# Altium project NB3000XN.PRJPCB (part 1 of 3)
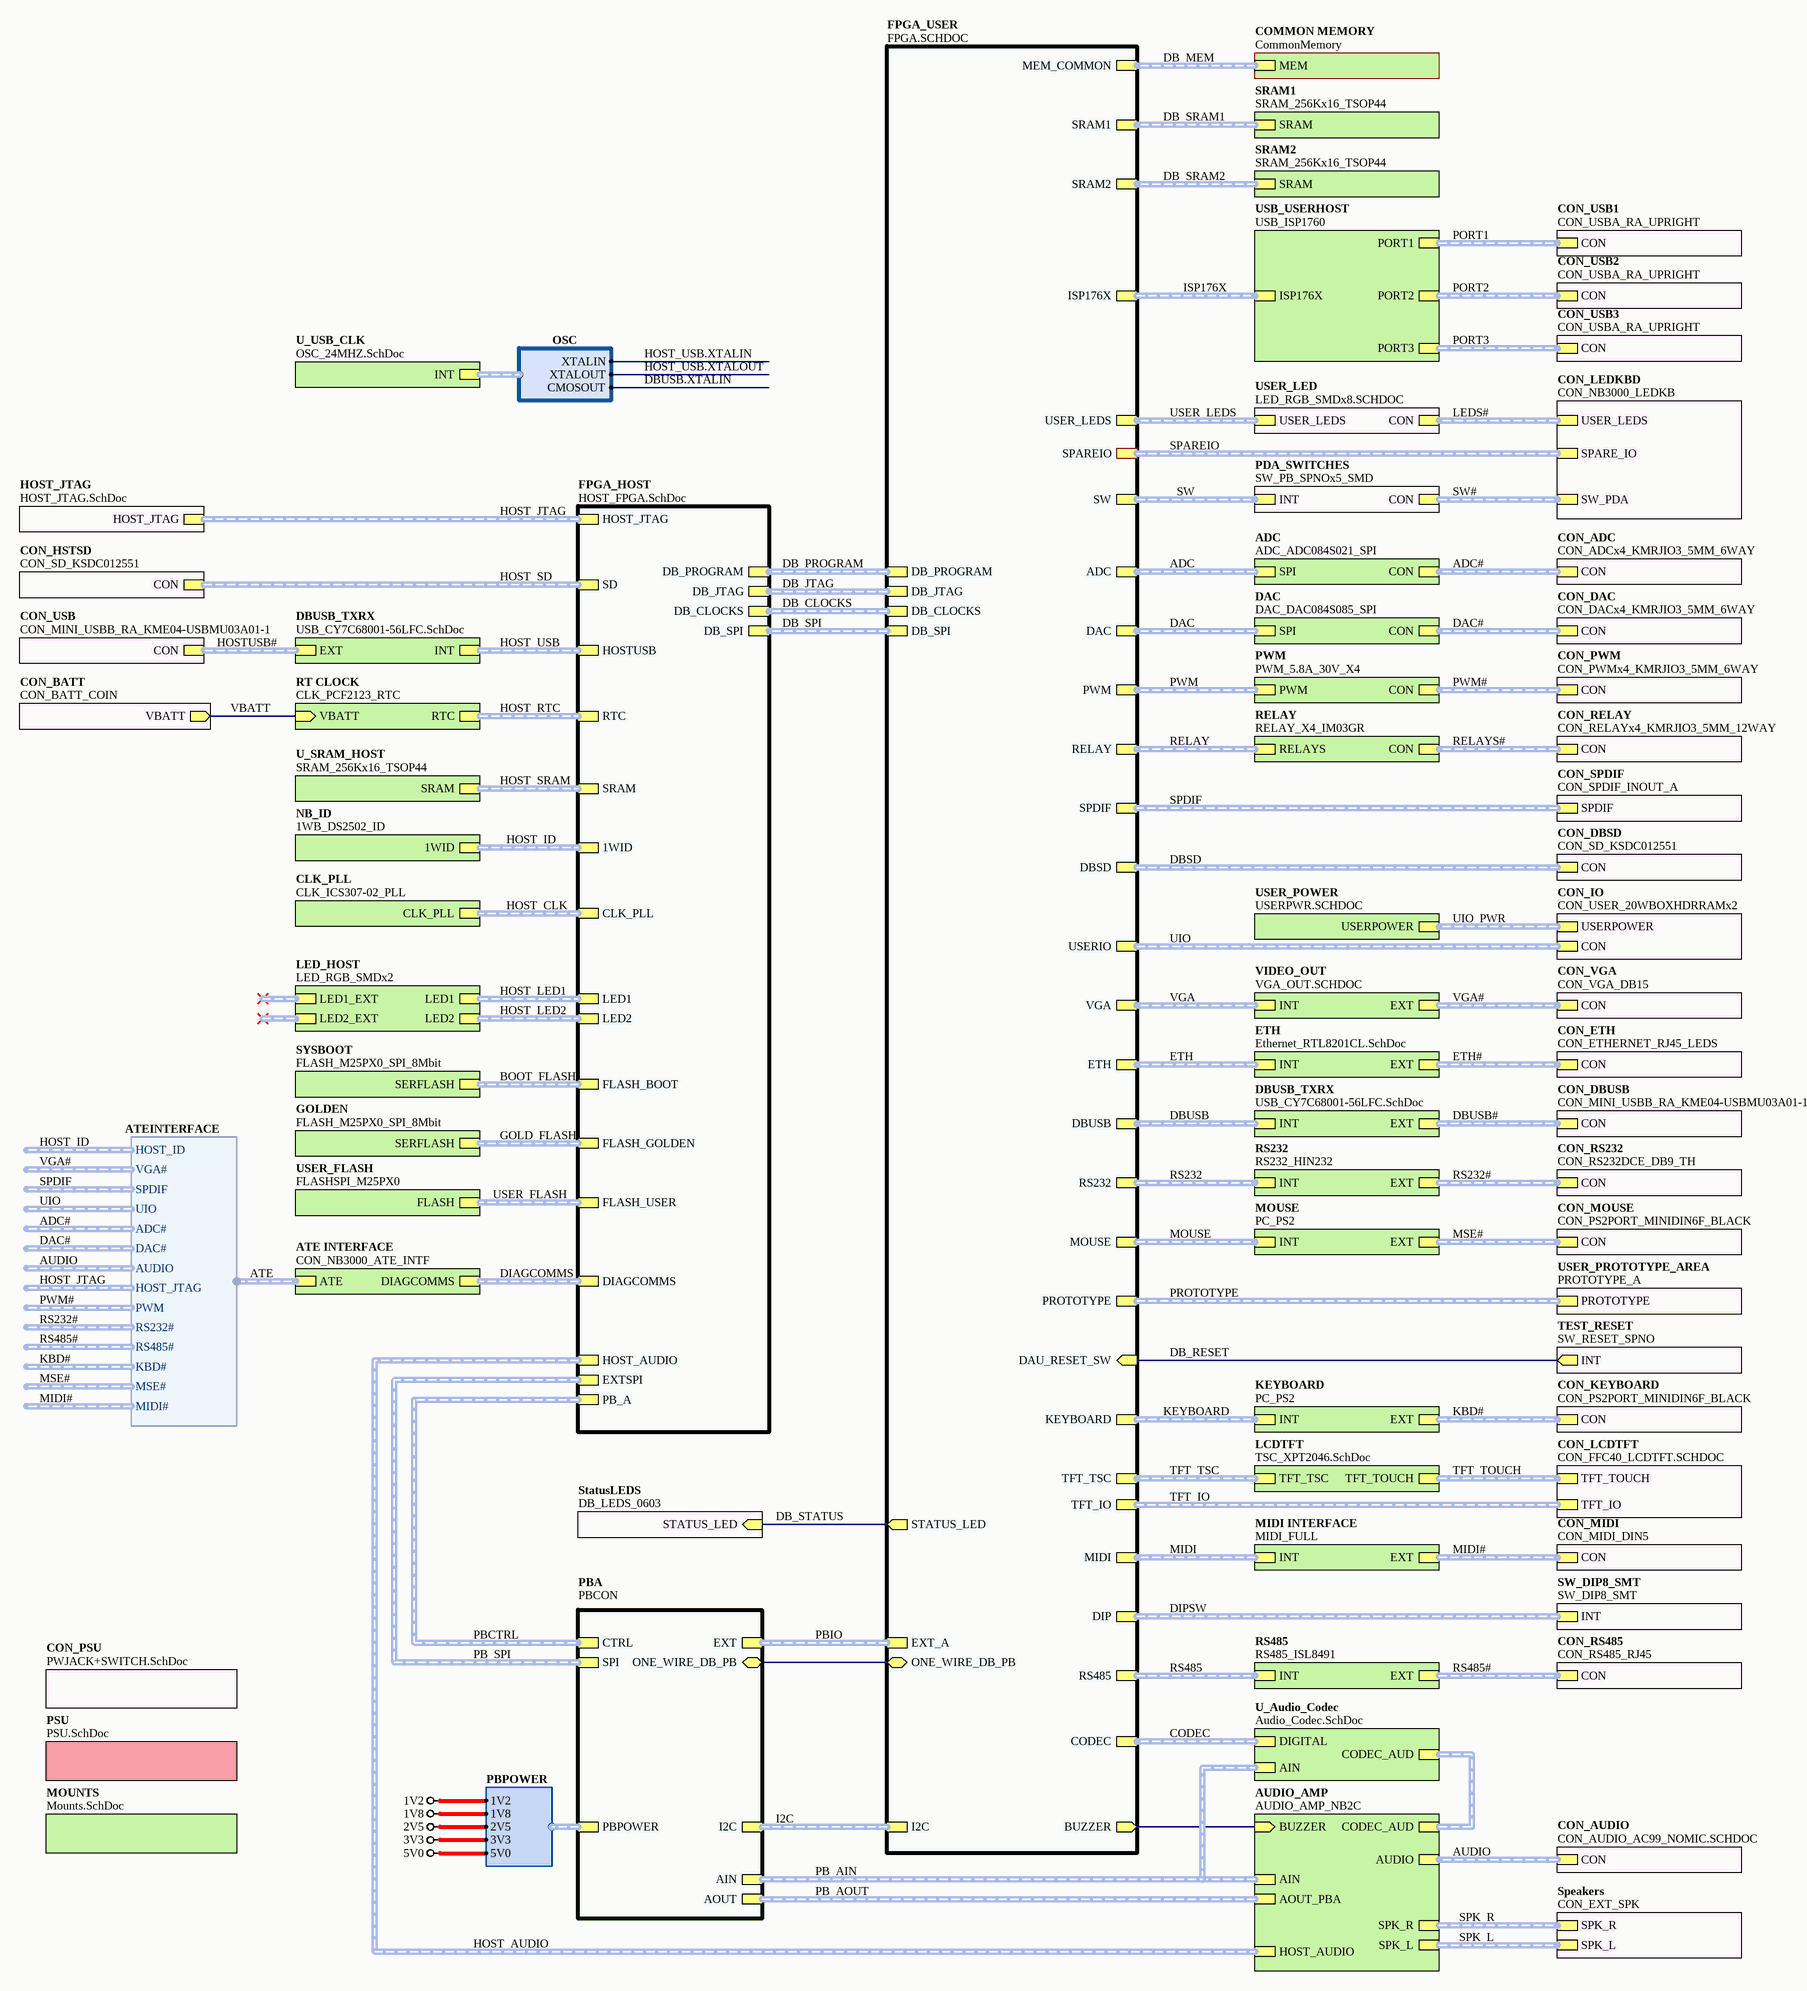
[diagram p0: NB3000XN_Top.SchDoc]
ProjectAddress1: 3 Minna Close; ProjectAddress2: Belrose; ProjectAddress3: NSW 2085; ProjectAddress4: Australia; ProjectAssyNum: TBA; ProjectOrganization: Altium Limited; ProjectRevision: 04; ProjectTitle: NB3000XN - Xilinx; ProjectTotalSheets: 106
22 sheets, 343 parts. Net scope: hierarchical (ports join the sheet entries above them; power ports are global).
Board files: NB3000XN.PcbDoc, NB3000XN_Panel.PcbDoc
Sheets:
  NB3000XN_Top.SchDoc
    PSU = PSU.SchDoc
    FPGA_USER = FPGA.SCHDOC
      U_FPGA_Power = FPGA_NonIO.SchDoc
      USER_DECOUPLING_CAPS_1V2 = FPGA_Bypass_1V2.SCHDOC
      USER_DECOUPLING_CAPS_3V3 = FPGA_Bypass_3V3.SCHDOC
    VIDEO_OUT = VGA_OUT.SCHDOC
      U_VIDEO_DAC = VIDEO_DAC_THS8134B.SchDoc
    FPGA_HOST = Host_FPGA.SchDoc
      HOST_NonIO = HOST_FPGA_NonIO.SchDoc
      HOST_DECOUPLING_CAPS_1V2 = FPGA_Bypass_1V2.SCHDOC
      HOST_DECOUPLING_CAPS_3V3 = FPGA_Bypass_3V3.SCHDOC
    HOST_JTAG = HOST_JTAG.SchDoc
    DBUSB_TXRX = USB_CY7C68001-56LFC.SchDoc
    ETH = Ethernet_RTL8201CL.SchDoc
    LCDTFT = TSC_XPT2046.SchDoc
    USER_LED = LED_RGB_SMDx8.SCHDOC
    U_Audio_Codec = Audio_Codec.SchDoc
    CON_LCDTFT = CON_FFC40_LCDTFT.SCHDOC
    MOUNTS = Mounts.SchDoc
    CON_PSU = PWJACK+SWITCH.SchDoc
    DBUSB_TXRX = USB_CY7C68001-56LFC.SchDoc
    USER_POWER = USERPWR.SchDoc
    CON_AUDIO = CON_AUDIO_AC99_NOMIC.SchDoc
    U_USB_CLK = OSC_24MHZ.SchDoc

## Sheet NB3000XN_Top.SchDoc: NB3000XN Top Level
size A2; Revision: 5; SheetNumber: 1; SheetTotal: 106; Organization: Altium Limited.; Address1: Level 3, 12a Rodborough Rd; Address2: Frenchs Forest 2086; Address3: NSW; Address4: AUSTRALIA

### Sub-sheets
ADC = ADC_ADC084S021_SPI (file not in this document): SPI (harness ADC_SPI), CON (harness ADC_CON)
ATE INTERFACE = CON_NB3000_ATE_INTF (file not in this document): ATE (harness ATEINTERFACE), DIAGCOMMS (harness DIAGCOMMS)
AUDIO_AMP = AUDIO_AMP_NB2C (file not in this document): BUZZER (in), CODEC_AUD (harness STEREO), AUDIO (harness AUDIO_EXT), SPK_L (harness SPEAKER), SPK_R (harness SPEAKER), HOST_AUDIO (harness STEREO), AIN (harness AUDIO_IN), AOUT_PBA (harness AUDIO_OUT)
CLK_PLL = CLK_ICS307-02_PLL (file not in this document): CLK_PLL (harness CLK_PLL)
COMMON MEMORY = CommonMemory (file not in this document): MEM (harness HOSTMEMORY)
CON_ADC = CON_ADCx4_KMRJIO3_5MM_6WAY (file not in this document): CON (harness ADC_CON)
CON_AUDIO = CON_AUDIO_AC99_NOMIC.SCHDOC: CON (harness AUDIO_EXT)
CON_BATT = CON_BATT_COIN (file not in this document): VBATT (out)
CON_DAC = CON_DACx4_KMRJIO3_5MM_6WAY (file not in this document): CON (harness DAC_CON)
CON_DBSD = CON_SD_KSDC012551 (file not in this document): CON (harness SD)
CON_DBUSB = CON_MINI_USBB_RA_KME04-USBMU03A01-1 (file not in this document): CON (harness USB_CON)
CON_ETH = CON_ETHERNET_RJ45_LEDS (file not in this document): CON (harness ETHERNET_CON)
CON_HSTSD = CON_SD_KSDC012551 (file not in this document): CON (harness SD)
CON_IO = CON_USER_20WBOXHDRRAMx2 (file not in this document): CON (harness IO36), USERPOWER (harness USERPOWER)
CON_KEYBOARD = CON_PS2PORT_MINIDIN6F_BLACK (file not in this document): CON (harness PS2)
CON_LCDTFT = CON_FFC40_LCDTFT.SCHDOC: TFT_IO (harness TFT_IO), TFT_TOUCH (harness TFT_TOUCH)
CON_LEDKBD = CON_NB3000_LEDKB (file not in this document): USER_LEDS (harness User_LEDS), SW_PDA (harness SW5), SPARE_IO (harness SPAREIO)
CON_MIDI = CON_MIDI_DIN5 (file not in this document): CON (harness MIDI_IO)
CON_MOUSE = CON_PS2PORT_MINIDIN6F_BLACK (file not in this document): CON (harness PS2)
CON_PSU = PWJACK+SWITCH.SchDoc: no entries
CON_PWM = CON_PWMx4_KMRJIO3_5MM_6WAY (file not in this document): CON (harness PWM_CON)
CON_RELAY = CON_RELAYx4_KMRJIO3_5MM_12WAY (file not in this document): CON (harness RELAY_CON4)
CON_RS232 = CON_RS232DCE_DB9_TH (file not in this document): CON (harness RS232_EXT)
CON_RS485 = CON_RS485_RJ45 (file not in this document): CON (harness RS485_EXT)
CON_SPDIF = CON_SPDIF_INOUT_A (file not in this document): SPDIF (harness SPDIF)
CON_USB = CON_MINI_USBB_RA_KME04-USBMU03A01-1 (file not in this document): CON (harness USB_CON)
CON_USB1 = CON_USBA_RA_UPRIGHT (file not in this document): CON (harness USB_CON)
CON_USB2 = CON_USBA_RA_UPRIGHT (file not in this document): CON (harness USB_CON)
CON_USB3 = CON_USBA_RA_UPRIGHT (file not in this document): CON (harness USB_CON)
CON_VGA = CON_VGA_DB15 (file not in this document): CON (harness VGA_CON)
DAC = DAC_DAC084S085_SPI (file not in this document): SPI (harness DAC_SPI), CON (harness DAC_CON)
DBUSB_TXRX = USB_CY7C68001-56LFC.SchDoc: EXT (harness USB_CON), INT (harness USB_INTF)
DBUSB_TXRX = USB_CY7C68001-56LFC.SchDoc: EXT (harness USB_CON), INT (harness USB_INTF)
ETH = Ethernet_RTL8201CL.SchDoc: INT (harness Ethernet), EXT (harness ETHERNET_CON)
FPGA_HOST = HOST_FPGA.SchDoc: HOST_JTAG (harness HARDSOFT_JTAG), LED1 (harness RGB_LED), LED2 (harness RGB_LED), 1WID (harness 1W), DB_PROGRAM (harness DAU_CTRL), CLK_PLL (harness CLK_PLL), FLASH_BOOT (harness SERFLASH), HOSTUSB (harness USB_INTF), SRAM (harness SRAM-256Kx16), RTC (harness RTC), SD (harness SD), HOST_AUDIO (harness STEREO), DB_JTAG (harness HARDSOFT_JTAG), DB_CLOCKS (harness DB_CLOCKS), FLASH_USER (harness SERIALFLASH), DB_SPI (harness DB_SPI), PB_A (harness PBCTRL), EXTSPI (harness EXTSPI), FLASH_GOLDEN (harness SERFLASH), DIAGCOMMS (harness DIAGCOMMS)
FPGA_USER = FPGA.SCHDOC: SRAM1 (harness SRAM-256Kx16), SRAM2 (harness SRAM-256Kx16), MEM_COMMON (harness HOSTMEMORY), DAU_RESET_SW (in), BUZZER (out), ONE_WIRE_DB_PB (bidir), SW (harness SW5), DIP (harness SW8), USERIO (harness IO36), EXT_A (harness PBIO), RS232 (harness RS232_INT), KEYBOARD (harness PS2), MOUSE (harness PS2), TFT_IO (harness TFT_IO), DB_PROGRAM (harness DAU_CTRL), STATUS_LED (out), USER_LEDS (harness USER_LEDS), RELAY (harness RELAY4), I2C (harness I2C), CODEC (harness AUDIO_DIGITAL), VGA (harness VGA), ETH (harness Ethernet), DBSD (harness SD), DBUSB (harness USB_INTF), PWM (harness PWM4), SPDIF (harness SPDIF), DAC (harness DAC_SPI), ADC (harness ADC_SPI), RS485 (harness RS485_INT), MIDI (harness MIDI_INT), DB_JTAG (harness HARDSOFT_JTAG), DB_CLOCKS (harness DB_CLOCKS), DB_SPI (harness DB_SPI), ISP176X (harness ISP176X), PROTOTYPE (harness IO36), SPAREIO (harness SPAREIO), TFT_TSC (harness TFT_TSC)
GOLDEN = FLASH_M25PX0_SPI_8Mbit (file not in this document): SERFLASH (harness SERFLASH)
HOST_JTAG = HOST_JTAG.SchDoc: HOST_JTAG (harness HARDSOFT_JTAG)
KEYBOARD = PC_PS2 (file not in this document): EXT (harness PS2), INT (harness PS2)
LCDTFT = TSC_XPT2046.SchDoc: TFT_TSC (harness TFT_TSC), TFT_TOUCH (harness TFT_TOUCH)
LED_HOST = LED_RGB_SMDx2 (file not in this document): LED1 (harness RGB_LED), LED2 (harness RGB_LED), LED1_EXT (harness RGB_LED), LED2_EXT (harness RGB_LED)
MIDI INTERFACE = MIDI_FULL (file not in this document): INT (harness MIDI_INT), EXT (harness MIDI_IO)
MOUNTS = Mounts.SchDoc: no entries
MOUSE = PC_PS2 (file not in this document): EXT (harness PS2), INT (harness PS2)
NB_ID = 1WB_DS2502_ID (file not in this document): 1WID (harness 1W)
PBA = PBCON (file not in this document): EXT (harness PBIO), ONE_WIRE_DB_PB (bidir), AIN (harness AUDIO_IN), I2C (harness I2C), SPI (harness EXTSPI), AOUT (harness AUDIO_OUT), CTRL (harness PBCTRL), PBPOWER (harness PBPOWER)
PDA_SWITCHES = SW_PB_SPNOx5_SMD (file not in this document): INT (harness SW5), CON (harness SW5)
PSU = PSU.SchDoc: no entries
PWM = PWM_5.8A_30V_X4 (file not in this document): PWM (harness PWM4), CON (harness PWM_CON)
RELAY = RELAY_X4_IM03GR (file not in this document): RELAYS (harness RELAY4), CON (harness RELAY_CON4)
RS232 = RS232_HIN232 (file not in this document): INT (harness RS232_INT), EXT (harness RS232_EXT)
RS485 = RS485_ISL8491 (file not in this document): INT (harness RS485_INT), EXT (harness RS485_EXT)
RT CLOCK = CLK_PCF2123_RTC (file not in this document): VBATT (in), RTC (harness RTC)
Speakers = CON_EXT_SPK (file not in this document): SPK_L (harness SPEAKER), SPK_R (harness SPEAKER)
SRAM1 = SRAM_256Kx16_TSOP44 (file not in this document): SRAM (harness SRAM-256Kx16)
SRAM2 = SRAM_256Kx16_TSOP44 (file not in this document): SRAM (harness SRAM-256Kx16)
StatusLEDS = DB_LEDS_0603 (file not in this document): STATUS_LED (in)
SW_DIP8_SMT = SW_DIP8_SMT (file not in this document): INT (harness SW8)
SYSBOOT = FLASH_M25PX0_SPI_8Mbit (file not in this document): SERFLASH (harness SERFLASH)
TEST_RESET = SW_RESET_SPNO (file not in this document): INT (out)
U_Audio_Codec = Audio_Codec.SchDoc: DIGITAL (harness AUDIO_DIGITAL), CODEC_AUD (harness STEREO), AIN (harness AUDIO_IN)
U_SRAM_HOST = SRAM_256Kx16_TSOP44 (file not in this document): SRAM (harness SRAM-256Kx16)
U_USB_CLK = OSC_24MHZ.SchDoc: INT (harness OSC)
USB_USERHOST = USB_ISP1760 (file not in this document): ISP176X (harness ISP176X), PORT1 (harness USB_CON), PORT2 (harness USB_CON), PORT3 (harness USB_CON)
USER_FLASH = FLASHSPI_M25PX0 (file not in this document): FLASH (harness SERIALFLASH)
USER_LED = LED_RGB_SMDx8.SCHDOC: USER_LEDS (harness USER_LEDS), CON (harness UseR_LEDS)
USER_POWER = USERPWR.SCHDOC: USERPOWER (harness USERPOWER)
USER_PROTOTYPE_AREA = PROTOTYPE_A (file not in this document): PROTOTYPE (harness IO36)
VIDEO_OUT = VGA_OUT.SCHDOC: INT (harness VGA), EXT (harness VGA_CON)

### Harnesses
PBPOWER: 1V2, 1V8, 2V5, 3V3, 5V0
ATEINTERFACE: VGA#, SPDIF, UIO, ADC#, DAC#, AUDIO, HOST_JTAG, PWM, RS232#, RS485#, KBD#, MSE#, MIDI#, HOST_ID
OSC: CMOSOUT, XTALIN, XTALOUT

### Nets
BUZZER: sheet FPGA_USER/BUZZER, sheet AUDIO_AMP/BUZZER
DB_RESET: sheet FPGA_USER/DAU_RESET_SW, sheet TEST_RESET/INT
DB_STATUS: sheet StatusLEDS/STATUS_LED, sheet FPGA_USER/STATUS_LED  [project net DB_PROGRAM.DONE]
ONE_WIRE_DB_PB: sheet FPGA_USER/ONE_WIRE_DB_PB, sheet PBA/ONE_WIRE_DB_PB
VBATT: sheet CON_BATT/VBATT, sheet RT CLOCK/VBATT

### Buses and harness runs
harness ADC = sheet ADC/SPI = sheet FPGA_USER/ADC
harness ADC# = sheet ADC/CON = sheet CON_ADC/CON
harness ATE = sheet ATE INTERFACE/ATE
harness AUDIO = sheet AUDIO_AMP/AUDIO = sheet CON_AUDIO/CON
harness BOOT_FLASH = sheet FPGA_HOST/FLASH_BOOT = sheet SYSBOOT/SERFLASH
harness CODEC = sheet FPGA_USER/CODEC = sheet U_Audio_Codec/DIGITAL
harness DAC = sheet DAC/SPI = sheet FPGA_USER/DAC
harness DAC# = sheet CON_DAC/CON = sheet DAC/CON
harness DB_CLOCKS = sheet FPGA_HOST/DB_CLOCKS = sheet FPGA_USER/DB_CLOCKS
harness DB_JTAG = sheet FPGA_HOST/DB_JTAG = sheet FPGA_USER/DB_JTAG
harness DB_MEM = sheet COMMON MEMORY/MEM = sheet FPGA_USER/MEM_COMMON
harness DB_PROGRAM = sheet FPGA_HOST/DB_PROGRAM = sheet FPGA_USER/DB_PROGRAM
harness DB_SPI = sheet FPGA_HOST/DB_SPI = sheet FPGA_USER/DB_SPI
harness DB_SRAM1 = sheet FPGA_USER/SRAM1 = sheet SRAM1/SRAM
harness DB_SRAM2 = sheet FPGA_USER/SRAM2 = sheet SRAM2/SRAM
harness DBSD = sheet CON_DBSD/CON = sheet FPGA_USER/DBSD
harness DBUSB = sheet DBUSB_TXRX/INT = sheet FPGA_USER/DBUSB
harness DBUSB# = sheet CON_DBUSB/CON = sheet DBUSB_TXRX/EXT
harness DIAGCOMMS = sheet ATE INTERFACE/DIAGCOMMS = sheet FPGA_HOST/DIAGCOMMS
harness DIPSW = sheet FPGA_USER/DIP = sheet SW_DIP8_SMT/INT
harness ETH = sheet ETH/INT = sheet FPGA_USER/ETH
harness ETH# = sheet CON_ETH/CON = sheet ETH/EXT
harness GOLD_FLASH = sheet FPGA_HOST/FLASH_GOLDEN = sheet GOLDEN/SERFLASH
harness HOST_AUDIO = sheet AUDIO_AMP/HOST_AUDIO = sheet FPGA_HOST/HOST_AUDIO
harness HOST_CLK = sheet CLK_PLL/CLK_PLL = sheet FPGA_HOST/CLK_PLL
harness HOST_ID = sheet FPGA_HOST/1WID = sheet NB_ID/1WID
harness HOST_JTAG = sheet FPGA_HOST/HOST_JTAG = sheet HOST_JTAG/HOST_JTAG
harness HOST_LED1 = sheet FPGA_HOST/LED1 = sheet LED_HOST/LED1
harness HOST_LED2 = sheet FPGA_HOST/LED2 = sheet LED_HOST/LED2
harness HOST_RTC = sheet FPGA_HOST/RTC = sheet RT CLOCK/RTC
harness HOST_SD = sheet CON_HSTSD/CON = sheet FPGA_HOST/SD
harness HOST_SRAM = sheet FPGA_HOST/SRAM = sheet U_SRAM_HOST/SRAM
harness HOST_USB = sheet DBUSB_TXRX/INT = sheet FPGA_HOST/HOSTUSB
harness HOSTUSB# = sheet CON_USB/CON = sheet DBUSB_TXRX/EXT
harness I2C = sheet FPGA_USER/I2C = sheet PBA/I2C
harness ISP176X = sheet FPGA_USER/ISP176X = sheet USB_USERHOST/ISP176X
harness KBD# = sheet CON_KEYBOARD/CON = sheet KEYBOARD/EXT
harness KEYBOARD = sheet FPGA_USER/KEYBOARD = sheet KEYBOARD/INT
harness LEDS# = sheet CON_LEDKBD/USER_LEDS = sheet USER_LED/CON
harness MIDI = sheet FPGA_USER/MIDI = sheet MIDI INTERFACE/INT
harness MIDI# = sheet CON_MIDI/CON = sheet MIDI INTERFACE/EXT
harness MOUSE = sheet FPGA_USER/MOUSE = sheet MOUSE/INT
harness MSE# = sheet CON_MOUSE/CON = sheet MOUSE/EXT
harness PB_AIN = sheet AUDIO_AMP/AIN = sheet PBA/AIN = sheet U_Audio_Codec/AIN
harness PB_AOUT = sheet AUDIO_AMP/AOUT_PBA = sheet PBA/AOUT
harness PB_SPI = sheet FPGA_HOST/EXTSPI = sheet PBA/SPI
harness PBCTRL = sheet FPGA_HOST/PB_A = sheet PBA/CTRL
harness PBIO = sheet FPGA_USER/EXT_A = sheet PBA/EXT
harness PORT1 = sheet CON_USB1/CON = sheet USB_USERHOST/PORT1
harness PORT2 = sheet CON_USB2/CON = sheet USB_USERHOST/PORT2
harness PORT3 = sheet CON_USB3/CON = sheet USB_USERHOST/PORT3
harness PROTOTYPE = sheet FPGA_USER/PROTOTYPE = sheet USER_PROTOTYPE_AREA/PROTOTYPE
harness PWM = sheet FPGA_USER/PWM = sheet PWM/PWM
harness PWM# = sheet CON_PWM/CON = sheet PWM/CON
harness RELAY = sheet FPGA_USER/RELAY = sheet RELAY/RELAYS
harness RELAYS# = sheet CON_RELAY/CON = sheet RELAY/CON
harness RS232 = sheet FPGA_USER/RS232 = sheet RS232/INT
harness RS232# = sheet CON_RS232/CON = sheet RS232/EXT
harness RS485 = sheet FPGA_USER/RS485 = sheet RS485/INT
harness RS485# = sheet CON_RS485/CON = sheet RS485/EXT
harness sheet AUDIO_AMP/CODEC_AUD = sheet U_Audio_Codec/CODEC_AUD
harness SPAREIO = sheet CON_LEDKBD/SPARE_IO = sheet FPGA_USER/SPAREIO
harness SPDIF = sheet CON_SPDIF/SPDIF = sheet FPGA_USER/SPDIF
harness SPK_L = sheet AUDIO_AMP/SPK_L = sheet Speakers/SPK_L
harness SPK_R = sheet AUDIO_AMP/SPK_R = sheet Speakers/SPK_R
harness SW = sheet FPGA_USER/SW = sheet PDA_SWITCHES/INT
harness SW# = sheet CON_LEDKBD/SW_PDA = sheet PDA_SWITCHES/CON
harness TFT_IO = sheet CON_LCDTFT/TFT_IO = sheet FPGA_USER/TFT_IO
harness TFT_TOUCH = sheet CON_LCDTFT/TFT_TOUCH = sheet LCDTFT/TFT_TOUCH
harness TFT_TSC = sheet FPGA_USER/TFT_TSC = sheet LCDTFT/TFT_TSC
harness UIO = sheet CON_IO/CON = sheet FPGA_USER/USERIO
harness UIO_PWR = sheet CON_IO/USERPOWER = sheet USER_POWER/USERPOWER
harness USER_FLASH = sheet FPGA_HOST/FLASH_USER = sheet USER_FLASH/FLASH
harness USER_LEDS = sheet FPGA_USER/USER_LEDS = sheet USER_LED/USER_LEDS
harness VGA = sheet FPGA_USER/VGA = sheet VIDEO_OUT/INT
harness VGA# = sheet CON_VGA/CON = sheet VIDEO_OUT/EXT

### Notes on the sheet
- Project Title
- Sheet Title
- Size:
- Date:
- File:
- A2
- Assy:
- Time:
- Revision:
- Sheet
- of

## Sheet PSU.SchDoc: NB3000 POWER SUPPLIES
size A4; Organization: Altium Limited.; Address1: 3 Minna Close; Address2: Belrose; Address3: NSW 2085; Address4: AUSTRALIA; DocumentNumber: 7; Revision: 6; SheetNumber: 8; SheetTotal: 78
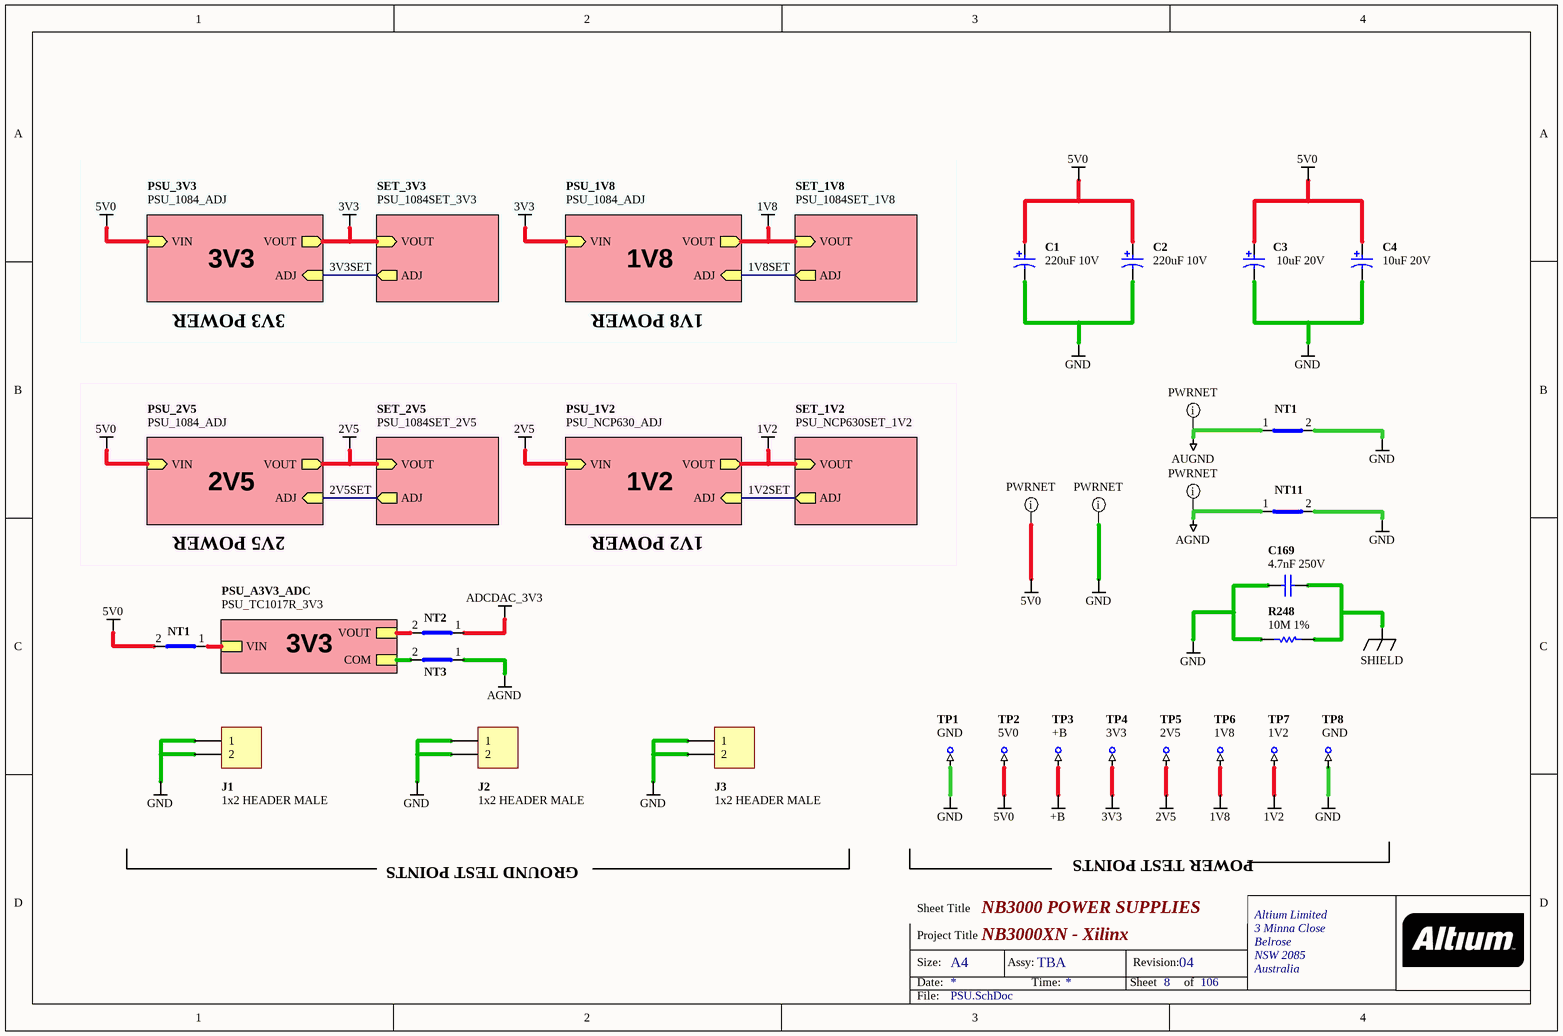
[diagram p1: PSU.SchDoc]

### Parts
(Parts that share a designator on the sheet are numbered #1, #2 ... from top to bottom, then left to right.)
C1#1  220uF 10V  [CAPC7343-STAR]
C2#1  220uF 10V  [CAPC7343-STAR]
C3#1  10uF 20V  [CAPC3528-STAR]
C4#1  10uF 20V  [CAPC3528-STAR]
C169  4.7nF 250V  [CAPM7163]
J1#1  1x2 HEADER MALE  [HDR1X2]
J2  1x2 HEADER MALE  [HDR1X2]
J3#1  1x2 HEADER MALE  [HDR1X2]
NT1#1  Net Tie SMT2  [NETTIE-SMT2-31X39]  (value not drawn)  (net tie, no BOM)
NT1#2  Net Tie SMT2  [NETTIE-SMT2-31X51]  (value not drawn)  (net tie, no BOM)
NT2#1  Net Tie SMT2  [NETTIE-SMT2-31X51]  (value not drawn)  (net tie, no BOM)
NT3#1  Net Tie SMT2  [NETTIE-SMT2-31X51]  (value not drawn)  (net tie, no BOM)
NT11#1  Net Tie SMT2  [NETTIE-SMT2-31X39]  (value not drawn)  (net tie, no BOM)
R248  10M 1%  [RESC3216]
TP1  GND  [TestPin]  (no BOM)
TP2  5V0  [TestPin]  (no BOM)
TP3  +B  [TestPin]  (no BOM)
TP4  3V3  [TestPin]  (no BOM)
TP5  2V5  [TestPin]  (no BOM)
TP6  1V8  [TestPin]  (no BOM)
TP7  1V2  [TestPin]  (no BOM)
TP8  GND  [TestPin]  (no BOM)

### Sub-sheets
PSU_1V2 = PSU_NCP630_ADJ (file not in this document): VIN (in), VOUT (out), ADJ (in)
PSU_1V8 = PSU_1084_ADJ (file not in this document): VIN (in), VOUT (out), ADJ (in)
PSU_2V5 = PSU_1084_ADJ (file not in this document): VIN (in), VOUT (out), ADJ (in)
PSU_3V3 = PSU_1084_ADJ (file not in this document): VIN (in), VOUT (out), ADJ (in)
PSU_A3V3_ADC = PSU_TC1017R_3V3 (file not in this document): VIN, VOUT, COM
SET_1V2 = PSU_NCP630SET_1V2 (file not in this document): VOUT (in), ADJ (out)
SET_1V8 = PSU_1084SET_1V8 (file not in this document): VOUT (in), ADJ (out)
SET_2V5 = PSU_1084SET_2V5 (file not in this document): VOUT (in), ADJ (out)
SET_3V3 = PSU_1084SET_3V3 (file not in this document): VOUT (in), ADJ (out)

### Nets
1V2: TP7.1 ; sheet PSU_1V2/VOUT, sheet SET_1V2/VOUT
1V8: TP6.1 ; sheet PSU_1V8/VOUT, sheet SET_1V8/VOUT
2V5: TP5.1 ; sheet PSU_1V2/VIN, sheet PSU_2V5/VOUT, sheet SET_2V5/VOUT
3V3: TP4.1 ; sheet PSU_1V8/VIN, sheet PSU_3V3/VOUT, sheet SET_3V3/VOUT
5V0: C1#1.1 C2#1.1 C3#1.1 C4#1.1 NT1#2.2(Net2) TP2.1 ; sheet PSU_2V5/VIN, sheet PSU_3V3/VIN
+B: TP3.1
ADCDAC_3V3: NT2#1.1(Net1)
AGND: NT3#1.1(Net1) NT11#1.1(Net1)
AUGND: NT1#1.1(Net1)
GND: C1#1.2 C2#1.2 C3#1.2 C4#1.2 C169.2 J1#1.1 J1#1.2 J2.1 J2.2 J3#1.1 J3#1.2 NT1#1.2(Net2) NT11#1.2(Net2) R248.2 TP1.1 TP8.1
SHIELD: C169.1 R248.1
1V2SET: sheet PSU_1V2/ADJ, sheet SET_1V2/ADJ
1V8SET: sheet PSU_1V8/ADJ, sheet SET_1V8/ADJ
2V5SET: sheet PSU_2V5/ADJ, sheet SET_2V5/ADJ
3V3SET: sheet PSU_3V3/ADJ, sheet SET_3V3/ADJ
NetNT1#2_1: NT1#2.1(Net1) ; sheet PSU_A3V3_ADC/VIN
NetNT2#1_2: NT2#1.2(Net2) ; sheet PSU_A3V3_ADC/VOUT
NetNT3#1_2: NT3#1.2(Net2) ; sheet PSU_A3V3_ADC/COM

### Layout directives
net class PWRNET: 5V0, AGND, AUGND, GND

### Notes on the sheet
- 3V3
- 3V3 POWER
- 1V8
- 1V8 POWER
- 2V5
- 1V2
- 2V5 POWER
- 1V2 POWER
- POWER TEST POINTS
- GROUND TEST POINTS
- Sheet Title
- Project Title
- Size:
- Date:
- A4
- Assy:
- Time:
- Sheet
- Revision:
- of
- File:

### Library data of the parts
C1#1 C2#1 = D-101-0088: Capacitor, Tantalum, 220uF 10% 10V MCCT-D (7343-31); Polarity: Polarized; Category: Capacitor; Capacitance: 220 uF; Mounting Technology: Surface Mount; Rated Voltage: 10 V; Status: Unreleased; Technology: Tantalum; Tolerance: 10 %
C3#1 C4#1 = D-101-0007: Capacitor, Tantalum, 10uF 10% 20V MCCT-B (3528); Polarity: Polarized; Category: Capacitor; Status: Production; Capacitance: 10 uF; Mounting Technology: Surface Mount; Rated Voltage: 20 V; Technology: Tantalum; Tolerance: 10 %
C169 = D-101-0019: Capacitor, Ceramic, 4.7nF 20% 250V Panasonic BC J Lead (CAPM7163) Y5V; Polarity: Non-Polarized; Tolerance: 20% %; Category: Capacitor; Capacitance: 4.7 nF; Dielectric: Y5V; Mounting Technology: Surface Mount; Rated Voltage: 250 V; Status: Production; Technology: Ceramic
J1#1 J2 J3#1 = D-300-0020: Header IDC, 2 x 1 Pin Vertical 2.54mm Pitch (Non-Boxed, Male); Max Current: 3 A; Category: Connector; Connector type: Header; Mounting Technology: Through-Hole; Pin Count: 2; Status: Production
NT1#1 NT11#1 = D-002-0004: Net-Tie, Surface Mount, 2 x 2.0mm x 0.8mm SMT Pads - For 0.8mm Track; Status: Production; Category: Net-Tie
NT1#2 NT2#1 NT3#1 = D-002-0003: Net-Tie, Surface Mount, 2 x 1.6mm x 0.8mm SMT Pads - For 0.8mm Track; Category: Net-Tie; Status: Production
R248 = D-100-0059: Resistor, 10M 1%1206 (3216); Power Rating: 250 mW; Category: Resistor; Mounting Technology: Surface Mount; Resistance: 10 M; Status: Deprecated; Tolerance: 1 %
TP1-TP8 = D-006-0000: Test Point, PCB Mount with Silkscreen Box; Category: Test-Point; Status: Production

## Sheet FPGA.SCHDOC: USER FPGA Connections
size A2; Organization: Altium Limited.; Address1: Level 3, 12a Rodborough Rd; Address2: Frenchs Forest 2086; Address3: NSW; Address4: AUSTRALIA; DocumentNumber: 9; SheetNumber: 10; SheetTotal: 78; PageSetup: Record=PageOptions|CenterHorizontal=True|CenterVertical=True|PrintScale=0.50|XCorrection=1.00|YCorrection=1.00|PrintKind=0|BorderSize=5000000|LeftOffset=0|BottomOffset=0|Orientation=2|PaperLength=4199|PaperWidth=2969|Scale=100|PaperSource=7|PrintQuality=600|MediaType=1|DitherType=10|PaperKind=A3 (297 x 420 mm)|PrintScaleMode=1
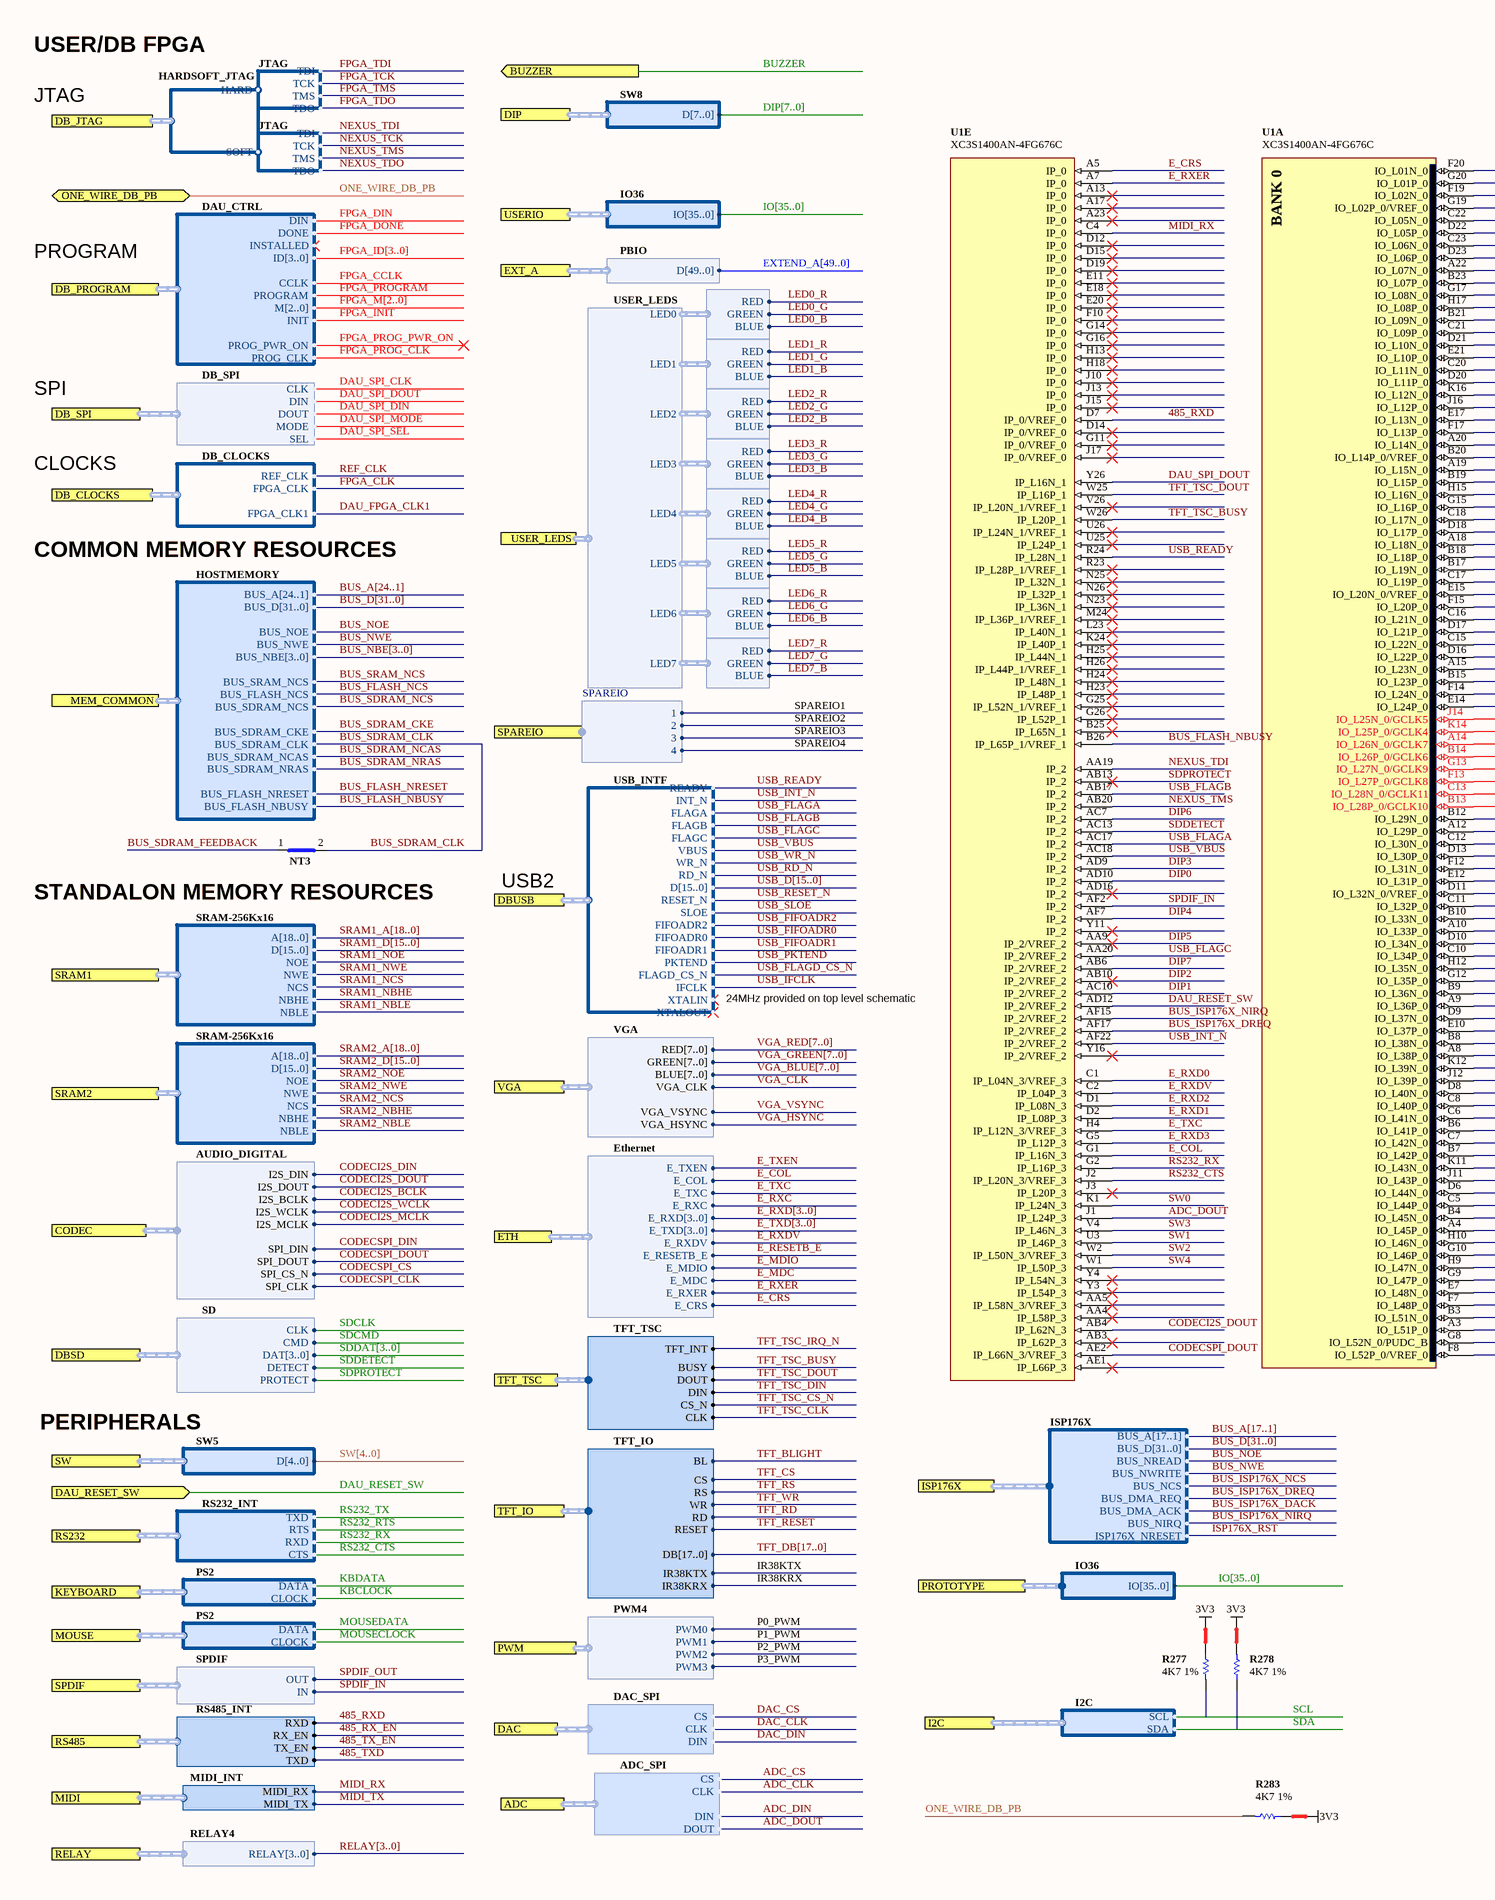
[diagram p2: FPGA.SCHDOC, left]
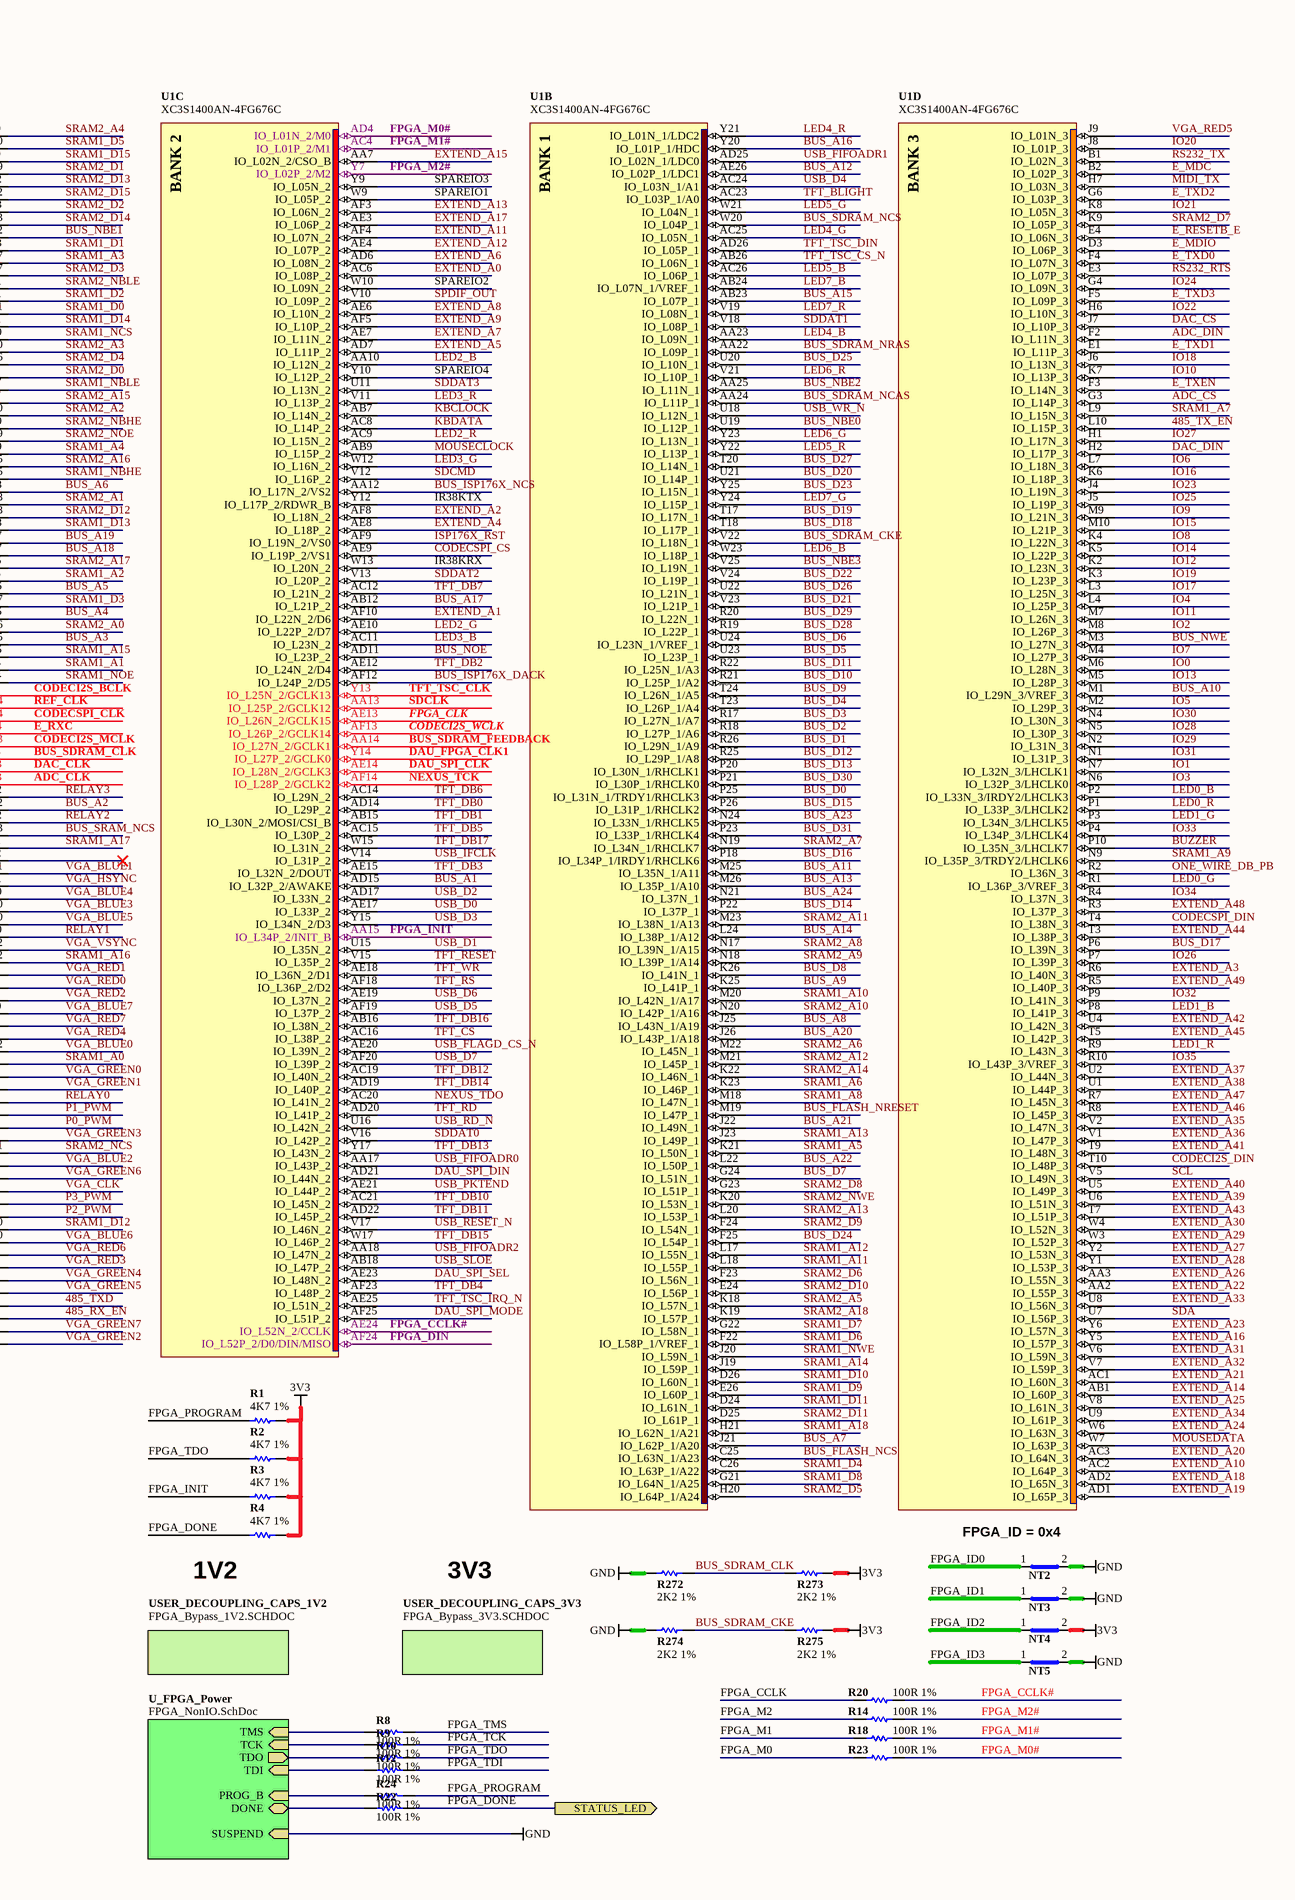
[diagram p3: FPGA.SCHDOC, right]

### Parts
(Parts that share a designator on the sheet are numbered #1, #2 ... from top to bottom, then left to right.)
NT2#2  Net Tie SMT2  [NETTIE-SMT2-8X8]  (value not drawn)  (net tie, no BOM)
NT3#2  Net Tie SMT2  [NETTIE-SMT2-8X8]  (value not drawn)  (net tie, no BOM)
NT3#3  Net Tie SMT2  [NETTIE-SMT2-8X8]  (value not drawn)  (net tie, no BOM)
NT4  Net Tie SMT2  [NETTIE-SMT2-8X8]  (value not drawn)  (net tie, no BOM)
NT5  Net Tie SMT2  [NETTIE-SMT2-8X8]  (value not drawn)  (net tie, no BOM)
R1#1  4K7 1%  [RESC1005-STAR]
R2#1  4K7 1%  [RESC1005-STAR]
R3#1  4K7 1%  [RESC1005-STAR]
R4#1  4K7 1%  [RESC1005-STAR]
R8#1  100R 1%  [RESC1005-STAR]
R9#1  100R 1%  [RESC1005-STAR]
R10#1  100R 1%  [RESC1005-STAR]
R12#1  100R 1%  [RESC1005-STAR]
R14#1  100R 1%  [RESC1005-STAR]
R18#1  100R 1%  [RESC1005-STAR]
R20#1  100R 1%  [RESC1005-STAR]
R22#1  100R 1%  [RESC1005-STAR]
R23#1  100R 1%  [RESC1005-STAR]
R24#1  100R 1%  [RESC1005-STAR]
R272  2K2 1%  [RESC1005-STAR]
R273  2K2 1%  [RESC1005-STAR]
R274  2K2 1%  [RESC1005-STAR]
R275  2K2 1%  [RESC1005-STAR]
R277  4K7 1%  [RESC1005-STAR]
R278  4K7 1%  [RESC1005-STAR]
R283  4K7 1%  [RESC1005-STAR]
U1#1  XC3S1400AN-4FG676C  [BGA100P26X26-676]  (parts A,B,C,D,E of 9)

### Sub-sheets
U_FPGA_Power = FPGA_NonIO.SchDoc: TMS (in), DONE (bidir), TCK (in), TDI (in), PROG_B (in), TDO (out), SUSPEND (in)
USER_DECOUPLING_CAPS_1V2 = FPGA_Bypass_1V2.SCHDOC: no entries
USER_DECOUPLING_CAPS_3V3 = FPGA_Bypass_3V3.SCHDOC: no entries

### Ports
ADC (harness ADC_SPI), BUZZER (out), CODEC (harness AUDIO_DIGITAL), DAC (harness DAC_SPI), DAU_RESET_SW (in), DB_CLOCKS (harness DB_CLOCKS), DB_JTAG (harness HARDSOFT_JTAG), DB_PROGRAM (harness DAU_CTRL), DB_SPI (harness DB_SPI), DBSD (harness SD), DBUSB (harness USB_INTF), DIP (harness SW8), ETH (harness Ethernet), EXT_A (harness PBIO), I2C (harness I2C), ISP176X (harness ISP176X), KEYBOARD (harness PS2), MEM_COMMON (harness HOSTMEMORY), MIDI (harness MIDI_INT), MOUSE (harness PS2), ONE_WIRE_DB_PB (bidir), PROTOTYPE (harness IO36), PWM (harness PWM4), RELAY (harness RELAY4), RS232 (harness RS232_INT), RS485 (harness RS485_INT), SPAREIO (harness SPAREIO), SPDIF (harness SPDIF), SRAM1 (harness SRAM-256Kx16), SRAM2 (harness SRAM-256Kx16), STATUS_LED (out), SW (harness SW5), TFT_IO (harness TFT_IO), TFT_TSC (harness TFT_TSC), USER_LEDS (harness USER_LEDS), USERIO (harness IO36), VGA (harness VGA)

### Harnesses
SRAM-256Kx16: A[18..0], D[15..0], NCS, NWE, NOE, NBHE, NBLE
HOSTMEMORY: BUS_A[24..1], BUS_D[31..0], BUS_NOE, BUS_NWE, BUS_NBE[3..0], BUS_SRAM_NCS, BUS_FLASH_NCS, BUS_SDRAM_NCS, BUS_SDRAM_CKE, BUS_SDRAM_CLK, BUS_SDRAM_NCAS, BUS_SDRAM_NRAS, BUS_FLASH_NRESET, BUS_FLASH_NBUSY
DAU_CTRL: DIN, DONE, INSTALLED, ID[3..0], CCLK, PROGRAM, M[2..0], INIT, PROG_PWR_ON, PROG_CLK
SW5: D[4..0]
PS2: DATA, CLOCK
RS232_INT: RXD, TXD, RTS, CTS
IO36: IO[35..0]
I2C: SCL, SDA
RGB_LED: GREEN, RED, BLUE
AUDIO_DIGITAL: I2S_DOUT, I2S_DIN, I2S_BCLK, I2S_WCLK, I2S_MCLK, SPI_CLK, SPI_DIN, SPI_DOUT, SPI_CS_N
SW8: D[7..0]
SD: CLK, CMD, DAT[3..0], DETECT, PROTECT
Ethernet: E_RXC, E_TXC, E_TXD[3..0], E_TXEN, E_COL, E_RXD[3..0], E_RXDV, E_RESETB_E, E_MDIO, E_MDC, E_RXER, E_CRS
SPDIF: IN, OUT
VGA: RED[7..0], GREEN[7..0], BLUE[7..0], VGA_CLK, VGA_VSYNC, VGA_HSYNC
RELAY4: RELAY[3..0]
ADC_SPI: CS, CLK, DIN, DOUT
DAC_SPI: CS, CLK, DIN
MIDI_INT: MIDI_TX, MIDI_RX
JTAG: TMS, TDO, TDI, TCK
HARDSOFT_JTAG: HARD, SOFT
DB_CLOCKS: REF_CLK, FPGA_CLK, FPGA_CLK1
PWM4: PWM0, PWM1, PWM2, PWM3
RS485_INT: TX_EN, RXD, RX_EN, TXD
DB_SPI: MODE, SEL, CLK, DIN, DOUT
TFT_IO: CS, RS, WR, RD, RESET, DB[17..0], BL, IR38KTX, IR38KRX
USER_LEDS: LED0, LED1, LED2, LED3, LED4, LED5, LED6, LED7
PBIO: D[49..0]
USB_INTF: READY, INT_N, SLOE, FIFOADR2, FIFOADR0, FIFOADR1, PKTEND, FLAGD_CS_N, FLAGA, FLAGB, FLAGC, WR_N, RD_N, D[15..0], RESET_N, IFCLK, XTALIN, VBUS, XTALOUT
ISP176X: BUS_A[17..1], BUS_D[31..0], BUS_NREAD, BUS_NCS, BUS_DMA_REQ, BUS_DMA_ACK, BUS_NIRQ, BUS_NWRITE, ISP176X_NRESET
SPAREIO: 1, 2, 3, 4
TFT_TSC: CLK, CS_N, DIN, DOUT, BUSY, TFT_INT

### Nets
3V3: NT4.2(Net2) R1#1.2 R2#1.2 R3#1.2 R4#1.2 R273.2 R275.2 R277.1 R278.2 R283.1
GND: NT2#2.2(Net2) NT3#3.2(Net2) NT5.2(Net2) R272.1 R274.1 ; sheet U_FPGA_Power/SUSPEND
485_RX_EN: U1#1.A3(IO_L51P_0) ; port RS485.RX_EN  [project net RS485.RX_EN]
485_RXD: U1#1.D7(IP_0/VREF_0) ; port RS485.RXD  [project net RS485.RXD]
485_TX_EN: U1#1.L10(IO_L15P_3) ; port RS485.TX_EN  [project net RS485.TX_EN]
485_TXD: U1#1.B3(IO_L51N_0) ; port RS485.TXD  [project net RS485.TXD]
ADC_CLK: U1#1.B13(IO_L28P_0/GCLK10) ; port ADC.CLK  [project net ADC.CLK]
ADC_CS: U1#1.G3(IO_L14P_3) ; port ADC.CS  [project net ADC.CS]
ADC_DIN: U1#1.F2(IO_L11N_3) ; port ADC.DIN  [project net ADC.DIN]
ADC_DOUT: U1#1.J1(IP_L24P_3) ; port ADC.DOUT  [project net ADC.DOUT]
BUS_A1: U1#1.AD15(IO_L32P_2/AWAKE)
BUS_A2: U1#1.A12(IO_L29P_0)
BUS_A3: U1#1.A15(IO_L23N_0)
BUS_A4: U1#1.C15(IO_L22N_0)
BUS_A5: U1#1.C16(IO_L21N_0)
BUS_A6: U1#1.C18(IO_L17N_0)
BUS_A7: U1#1.J21(IO_L62P_1/A20)
BUS_A8: U1#1.J25(IO_L43N_1/A19)
BUS_A9: U1#1.K25(IO_L41P_1)
BUS_A10: U1#1.M1(IO_L29N_3/VREF_3)
BUS_A11: U1#1.M25(IO_L35N_1/A11)
BUS_A12: U1#1.AE26(IO_L02P_1/LDC1)
BUS_A13: U1#1.M26(IO_L35P_1/A10)
BUS_A14: U1#1.L24(IO_L38P_1/A12)
BUS_A15: U1#1.AB23(IO_L07P_1)
BUS_A16: U1#1.Y20(IO_L01P_1/HDC)
BUS_A17: U1#1.AB12(IO_L21P_2)
BUS_A18: U1#1.C17(IO_L19P_0)
BUS_A19: U1#1.B17(IO_L19N_0)
BUS_A20: U1#1.J26(IO_L43P_1/A18)
BUS_A21: U1#1.J22(IO_L49N_1)
BUS_A22: U1#1.L22(IO_L50P_1)
BUS_A23: U1#1.N24(IO_L33N_1/RHCLK5)
BUS_A24: U1#1.N21(IO_L37N_1)
BUS_D0: U1#1.P25(IO_L31N_1/TRDY1/RHCLK3)
BUS_D1: U1#1.R26(IO_L29N_1/A9)
BUS_D2: U1#1.R18(IO_L27P_1/A6)
BUS_D3: U1#1.R17(IO_L27N_1/A7)
BUS_D4: U1#1.T23(IO_L26P_1/A4)
BUS_D5: U1#1.U23(IO_L23P_1)
BUS_D6: U1#1.U24(IO_L23N_1/VREF_1)
BUS_D7: U1#1.G24(IO_L51N_1)
BUS_D8: U1#1.K26(IO_L41N_1)
BUS_D9: U1#1.T24(IO_L26N_1/A5)
BUS_D10: U1#1.R21(IO_L25P_1/A2)
BUS_D11: U1#1.R22(IO_L25N_1/A3)
BUS_D12: U1#1.R25(IO_L29P_1/A8)
BUS_D13: U1#1.P20(IO_L30N_1/RHCLK1)
BUS_D14: U1#1.P22(IO_L37P_1)
BUS_D15: U1#1.P26(IO_L31P_1/RHCLK2)
BUS_D16: U1#1.P18(IO_L34P_1/IRDY1/RHCLK6)
BUS_D17: U1#1.P6(IO_L39N_3)
BUS_D18: U1#1.T18(IO_L17P_1)
BUS_D19: U1#1.T17(IO_L17N_1)
BUS_D20: U1#1.U21(IO_L14P_1)
BUS_D21: U1#1.V23(IO_L21P_1)
BUS_D22: U1#1.V24(IO_L19P_1)
BUS_D23: U1#1.Y25(IO_L15N_1)
BUS_D24: U1#1.F25(IO_L54P_1)
BUS_D25: U1#1.U20(IO_L10N_1)
BUS_D26: U1#1.U22(IO_L21N_1)
BUS_D27: U1#1.T20(IO_L14N_1)
BUS_D28: U1#1.R19(IO_L22P_1)
BUS_D29: U1#1.R20(IO_L22N_1)
BUS_D30: U1#1.P21(IO_L30P_1/RHCLK0)
BUS_D31: U1#1.P23(IO_L33P_1/RHCLK4)
BUS_FLASH_NBUSY: U1#1.B26(IP_L65P_1/VREF_1) ; port MEM_COMMON.BUS_FLASH_NBUSY  [project net DB_MEM.BUS_FLASH_NBUSY]
BUS_FLASH_NCS: U1#1.C25(IO_L63N_1/A23) ; port MEM_COMMON.BUS_FLASH_NCS  [project net DB_MEM.BUS_FLASH_NCS]
BUS_FLASH_NRESET: U1#1.M19(IO_L47P_1) ; port MEM_COMMON.BUS_FLASH_NRESET  [project net DB_MEM.BUS_FLASH_NRESET]
BUS_ISP176X_DACK: U1#1.AF12(IO_L24P_2/D5) ; port ISP176X.BUS_DMA_ACK  [project net ISP176X.BUS_DMA_ACK]
BUS_ISP176X_DREQ: U1#1.AF17(IP_2/VREF_2) ; port ISP176X.BUS_DMA_REQ  [project net ISP176X.BUS_DMA_REQ]
BUS_ISP176X_NCS: U1#1.AA12(IO_L17N_2/VS2) ; port ISP176X.BUS_NCS  [project net ISP176X.BUS_NCS]
BUS_ISP176X_NIRQ: U1#1.AF15(IP_2/VREF_2) ; port ISP176X.BUS_NIRQ  [project net ISP176X.BUS_NIRQ]
BUS_NBE0: U1#1.U19(IO_L12P_1)
BUS_NBE1: U1#1.A22(IO_L07N_0)
BUS_NBE2: U1#1.AA25(IO_L11N_1)
BUS_NBE3: U1#1.V25(IO_L19N_1)
BUS_NOE: U1#1.AD11(IO_L23P_2) ; port MEM_COMMON.BUS_NOE, port ISP176X.BUS_NREAD  [project net DB_MEM.BUS_NOE]
BUS_NWE: U1#1.M3(IO_L27N_3) ; port MEM_COMMON.BUS_NWE, port ISP176X.BUS_NWRITE  [project net DB_MEM.BUS_NWE]
BUS_SDRAM_CKE: R274.2 R275.1 U1#1.V22(IO_L18N_1) ; port MEM_COMMON.BUS_SDRAM_CKE  [project net DB_MEM.BUS_SDRAM_CKE]
BUS_SDRAM_CLK: NT3#2.2(Net2) R272.2 R273.1 U1#1.F13(IO_L27P_0/GCLK8) ; port MEM_COMMON.BUS_SDRAM_CLK  [project net DB_MEM.BUS_SDRAM_CLK]
BUS_SDRAM_FEEDBACK: NT3#2.1(Net1) U1#1.AA14(IO_L27N_2/GCLK1)
BUS_SDRAM_NCAS: U1#1.AA24(IO_L11P_1) ; port MEM_COMMON.BUS_SDRAM_NCAS  [project net DB_MEM.BUS_SDRAM_NCAS]
BUS_SDRAM_NCS: U1#1.W20(IO_L04P_1) ; port MEM_COMMON.BUS_SDRAM_NCS  [project net DB_MEM.BUS_SDRAM_NCS]
BUS_SDRAM_NRAS: U1#1.AA22(IO_L09P_1) ; port MEM_COMMON.BUS_SDRAM_NRAS  [project net DB_MEM.BUS_SDRAM_NRAS]
BUS_SRAM_NCS: U1#1.D13(IO_L30P_0) ; port MEM_COMMON.BUS_SRAM_NCS  [project net DB_MEM.BUS_SRAM_NCS]
BUZZER: U1#1.P10(IO_L35N_3/LHCLK7) ; port BUZZER
CODECI2S_BCLK: U1#1.J14(IO_L25N_0/GCLK5) ; port CODEC.I2S_BCLK  [project net CODEC.I2S_BCLK]
CODECI2S_DIN: U1#1.T10(IO_L48P_3) ; port CODEC.I2S_DIN  [project net CODEC.I2S_DIN]
CODECI2S_DOUT: U1#1.AB4(IP_L62N_3) ; port CODEC.I2S_DOUT  [project net CODEC.I2S_DOUT]
CODECI2S_MCLK: U1#1.G13(IO_L27N_0/GCLK9) ; port CODEC.I2S_MCLK  [project net CODEC.I2S_MCLK]
CODECI2S_WCLK: U1#1.AF13(IO_L26P_2/GCLK14) ; port CODEC.I2S_WCLK  [project net CODEC.I2S_WCLK]
CODECSPI_CLK: U1#1.A14(IO_L26N_0/GCLK7) ; port CODEC.SPI_CLK  [project net CODEC.SPI_CLK]
CODECSPI_CS: U1#1.AE9(IO_L19P_2/VS1) ; port CODEC.SPI_CS_N  [project net CODEC.SPI_CS_N]
CODECSPI_DIN: U1#1.T4(IO_L38N_3) ; port CODEC.SPI_DIN  [project net CODEC.SPI_DIN]
CODECSPI_DOUT: U1#1.AE2(IP_L66N_3/VREF_3) ; port CODEC.SPI_DOUT  [project net CODEC.SPI_DOUT]
DAC_CLK: U1#1.C13(IO_L28N_0/GCLK11) ; port DAC.CLK  [project net DAC.CLK]
DAC_CS: U1#1.J7(IO_L10P_3) ; port DAC.CS  [project net DAC.CS]
DAC_DIN: U1#1.H2(IO_L17P_3) ; port DAC.DIN  [project net DAC.DIN]
DAU_FPGA_CLK1: U1#1.Y14(IO_L27P_2/GCLK0) ; port DB_CLOCKS.FPGA_CLK1  [project net DB_CLOCKS.FPGA_CLK1]
DAU_RESET_SW: U1#1.AD12(IP_2/VREF_2) ; port DAU_RESET_SW  [project net DB_RESET]
DAU_SPI_CLK: U1#1.AE14(IO_L28N_2/GCLK3) ; port DB_SPI.CLK  [project net DB_SPI.CLK]
DAU_SPI_DIN: U1#1.AD21(IO_L44N_2) ; port DB_SPI.DOUT  [project net DB_SPI.DOUT]
DAU_SPI_DOUT: U1#1.Y26(IP_L16N_1) ; port DB_SPI.DIN  [project net DB_SPI.DIN]
DAU_SPI_MODE: U1#1.AF25(IO_L51P_2) ; port DB_SPI.MODE  [project net DB_SPI.MODE]
DAU_SPI_SEL: U1#1.AE23(IO_L48N_2) ; port DB_SPI.SEL  [project net DB_SPI.SEL]
DIP0: U1#1.AD10(IP_2)
DIP1: U1#1.AC10(IP_2/VREF_2)
DIP2: U1#1.AB10(IP_2/VREF_2)
DIP3: U1#1.AD9(IP_2)
DIP4: U1#1.AF7(IP_2)
DIP5: U1#1.AA9(IP_2/VREF_2)
DIP6: U1#1.AC7(IP_2)
DIP7: U1#1.AB6(IP_2/VREF_2)
DONE: R22#1.2 ; sheet U_FPGA_Power/DONE
E_COL: U1#1.G1(IP_L16N_3) ; port ETH.E_COL  [project net ETH.E_COL]
E_CRS: U1#1.A5(IP_0) ; port ETH.E_CRS  [project net ETH.E_CRS]
E_MDC: U1#1.B2(IO_L02P_3) ; port ETH.E_MDC  [project net ETH.E_MDC]
E_MDIO: U1#1.D3(IO_L06P_3) ; port ETH.E_MDIO  [project net ETH.E_MDIO]
E_RESETB_E: U1#1.E4(IO_L06N_3) ; port ETH.E_RESETB_E  [project net ETH.E_RESETB_E]
E_RXC: U1#1.B14(IO_L26P_0/GCLK6) ; port ETH.E_RXC  [project net ETH.E_RXC]
E_RXD0: U1#1.C1(IP_L04N_3/VREF_3)
E_RXD1: U1#1.D2(IP_L08P_3)
E_RXD2: U1#1.D1(IP_L08N_3)
E_RXD3: U1#1.G5(IP_L12P_3)
E_RXDV: U1#1.C2(IP_L04P_3) ; port ETH.E_RXDV  [project net ETH.E_RXDV]
E_RXER: U1#1.A7(IP_0) ; port ETH.E_RXER  [project net ETH.E_RXER]
E_TXC: U1#1.H4(IP_L12N_3/VREF_3) ; port ETH.E_TXC  [project net ETH.E_TXC]
E_TXD0: U1#1.F4(IO_L07N_3)
E_TXD1: U1#1.E1(IO_L11P_3)
E_TXD2: U1#1.G6(IO_L03P_3)
E_TXD3: U1#1.F5(IO_L09P_3)
E_TXEN: U1#1.F3(IO_L14N_3) ; port ETH.E_TXEN  [project net ETH.E_TXEN]
EXTEND_A0: U1#1.AC6(IO_L08P_2)
EXTEND_A1: U1#1.AF10(IO_L22N_2/D6)
EXTEND_A2: U1#1.AF8(IO_L18N_2)
EXTEND_A3: U1#1.R6(IO_L40N_3)
EXTEND_A4: U1#1.AE8(IO_L18P_2)
EXTEND_A5: U1#1.AD7(IO_L11P_2)
EXTEND_A6: U1#1.AD6(IO_L08N_2)
EXTEND_A7: U1#1.AE7(IO_L11N_2)
EXTEND_A8: U1#1.AE6(IO_L10N_2)
EXTEND_A9: U1#1.AF5(IO_L10P_2)
EXTEND_A10: U1#1.AC2(IO_L64P_3)
EXTEND_A11: U1#1.AF4(IO_L07N_2)
EXTEND_A12: U1#1.AE4(IO_L07P_2)
EXTEND_A13: U1#1.AF3(IO_L06N_2)
EXTEND_A14: U1#1.AB1(IO_L60P_3)
EXTEND_A15: U1#1.AA7(IO_L02N_2/CSO_B)
EXTEND_A16: U1#1.Y5(IO_L57P_3)
EXTEND_A17: U1#1.AE3(IO_L06P_2)
EXTEND_A18: U1#1.AD2(IO_L65N_3)
EXTEND_A19: U1#1.AD1(IO_L65P_3)
EXTEND_A20: U1#1.AC3(IO_L64N_3)
EXTEND_A21: U1#1.AC1(IO_L60N_3)
EXTEND_A22: U1#1.AA2(IO_L55P_3)
EXTEND_A23: U1#1.Y6(IO_L57N_3)
EXTEND_A24: U1#1.W6(IO_L63N_3)
EXTEND_A25: U1#1.V8(IO_L61N_3)
EXTEND_A26: U1#1.AA3(IO_L55N_3)
EXTEND_A27: U1#1.Y2(IO_L53N_3)
EXTEND_A28: U1#1.Y1(IO_L53P_3)
EXTEND_A29: U1#1.W3(IO_L52P_3)
EXTEND_A30: U1#1.W4(IO_L52N_3)
EXTEND_A31: U1#1.V6(IO_L59N_3)
EXTEND_A32: U1#1.V7(IO_L59P_3)
EXTEND_A33: U1#1.U8(IO_L56N_3)
EXTEND_A34: U1#1.U9(IO_L61P_3)
EXTEND_A35: U1#1.V2(IO_L47N_3)
EXTEND_A36: U1#1.V1(IO_L47P_3)
EXTEND_A37: U1#1.U2(IO_L44N_3)
EXTEND_A38: U1#1.U1(IO_L44P_3)
EXTEND_A39: U1#1.U6(IO_L51N_3)
EXTEND_A40: U1#1.U5(IO_L49P_3)
EXTEND_A41: U1#1.T9(IO_L48N_3)
EXTEND_A42: U1#1.U4(IO_L42N_3)
EXTEND_A43: U1#1.T7(IO_L51P_3)
EXTEND_A44: U1#1.T3(IO_L38P_3)
EXTEND_A45: U1#1.T5(IO_L42P_3)
EXTEND_A46: U1#1.R8(IO_L45P_3)
EXTEND_A47: U1#1.R7(IO_L45N_3)
EXTEND_A48: U1#1.R3(IO_L37P_3)
EXTEND_A49: U1#1.R5(IO_L40P_3)
FPGA_CCLK: R20#1.1 ; port DB_PROGRAM.CCLK  [project net DB_PROGRAM.CCLK]
FPGA_CCLK#: R20#1.2 U1#1.AE24(IO_L52N_2/CCLK)
FPGA_CLK: U1#1.AE13(IO_L26N_2/GCLK15) ; port DB_CLOCKS.FPGA_CLK  [project net DB_CLOCKS.FPGA_CLK]
FPGA_DIN: U1#1.AF24(IO_L52P_2/D0/DIN/MISO) ; port DB_PROGRAM.DIN  [project net DB_PROGRAM.DIN]
FPGA_DONE: R4#1.1 R22#1.1 ; port STATUS_LED, port DB_PROGRAM.DONE  [project net DB_PROGRAM.DONE]
FPGA_ID0: NT2#2.1(Net1)
FPGA_ID1: NT3#3.1(Net1)
FPGA_ID2: NT4.1(Net1)
FPGA_ID3: NT5.1(Net1)
FPGA_INIT: R3#1.1 U1#1.AA15(IO_L34P_2/INIT_B) ; port DB_PROGRAM.INIT  [project net DB_PROGRAM.INIT]
FPGA_M0: R23#1.1
FPGA_M0#: R23#1.2 U1#1.AD4(IO_L01N_2/M0)
FPGA_M1: R18#1.1
FPGA_M1#: R18#1.2 U1#1.AC4(IO_L01P_2/M1)
FPGA_M2: R14#1.1
FPGA_M2#: R14#1.2 U1#1.Y7(IO_L02P_2/M2)
FPGA_PROG_CLK: port DB_PROGRAM.PROG_CLK  [project net DB_PROGRAM.PROG_CLK]
FPGA_PROG_PWR_ON: port DB_PROGRAM.PROG_PWR_ON  [project net DB_PROGRAM.PROG_PWR_ON]
FPGA_PROGRAM: R1#1.1 R24#1.1 ; port DB_PROGRAM.PROGRAM  [project net DB_PROGRAM.PROGRAM]
FPGA_TCK: R9#1.1 ; harness JTAG.TCK
FPGA_TDI: R12#1.1 ; harness JTAG.TDI
FPGA_TDO: R2#1.1 R10#1.1 ; harness JTAG.TDO
FPGA_TMS: R8#1.1 ; harness JTAG.TMS
IO0: U1#1.M6(IO_L28N_3)
IO1: U1#1.N7(IO_L32N_3/LHCLK1)
IO2: U1#1.M8(IO_L26P_3)
IO3: U1#1.N6(IO_L32P_3/LHCLK0)
IO4: U1#1.L4(IO_L25P_3)
IO5: U1#1.M2(IO_L29P_3)
IO6: U1#1.L7(IO_L18N_3)
IO7: U1#1.M4(IO_L27P_3)
IO8: U1#1.K4(IO_L22N_3)
IO9: U1#1.M9(IO_L21N_3)
IO10: U1#1.K7(IO_L13P_3)
IO11: U1#1.M7(IO_L26N_3)
IO12: U1#1.K2(IO_L23N_3)
IO13: U1#1.M5(IO_L28P_3)
IO14: U1#1.K5(IO_L22P_3)
IO15: U1#1.M10(IO_L21P_3)
IO16: U1#1.K6(IO_L18P_3)
IO17: U1#1.L3(IO_L25N_3)
IO18: U1#1.J6(IO_L13N_3)
IO19: U1#1.K3(IO_L23P_3)
IO20: U1#1.J8(IO_L01P_3)
IO21: U1#1.K8(IO_L05N_3)
IO22: U1#1.H6(IO_L10N_3)
IO23: U1#1.J4(IO_L19N_3)
IO24: U1#1.G4(IO_L09N_3)
IO25: U1#1.J5(IO_L19P_3)
IO26: U1#1.P7(IO_L39P_3)
IO27: U1#1.H1(IO_L17N_3)
IO28: U1#1.N5(IO_L30P_3)
IO29: U1#1.N2(IO_L31N_3)
IO30: U1#1.N4(IO_L30N_3)
IO31: U1#1.N1(IO_L31P_3)
IO32: U1#1.P9(IO_L41N_3)
IO33: U1#1.P4(IO_L34P_3/LHCLK4)
IO34: U1#1.R4(IO_L37N_3)
IO35: U1#1.R10(IO_L43P_3/VREF_3)
IR38KRX: U1#1.W13(IO_L20N_2) ; port TFT_IO.IR38KRX  [project net TFT_IO.IR38KRX]
IR38KTX: U1#1.Y12(IO_L17P_2/RDWR_B) ; port TFT_IO.IR38KTX  [project net TFT_IO.IR38KTX]
ISP176X_RST: U1#1.AF9(IO_L19N_2/VS0) ; port ISP176X.ISP176X_NRESET  [project net ISP176X.ISP176X_NRESET]
KBCLOCK: U1#1.AB7(IO_L14N_2) ; port KEYBOARD.CLOCK  [project net KEYBOARD.CLOCK]
KBDATA: U1#1.AC8(IO_L14P_2) ; port KEYBOARD.DATA  [project net KEYBOARD.DATA]
LED0_B: U1#1.P2(IO_L33N_3/IRDY2/LHCLK3) ; harness RGB_LED.BLUE
LED0_G: U1#1.R1(IO_L36P_3/VREF_3) ; harness RGB_LED.GREEN
LED0_R: U1#1.P1(IO_L33P_3/LHCLK2) ; harness RGB_LED.RED
LED1_B: U1#1.P8(IO_L41P_3) ; harness RGB_LED.BLUE
LED1_G: U1#1.P3(IO_L34N_3/LHCLK5) ; harness RGB_LED.GREEN
LED1_R: U1#1.R9(IO_L43N_3) ; harness RGB_LED.RED
LED2_B: U1#1.AA10(IO_L12N_2) ; harness RGB_LED.BLUE
LED2_G: U1#1.AE10(IO_L22P_2/D7) ; harness RGB_LED.GREEN
LED2_R: U1#1.AC9(IO_L15N_2) ; harness RGB_LED.RED
LED3_B: U1#1.AC11(IO_L23N_2) ; harness RGB_LED.BLUE
LED3_G: U1#1.W12(IO_L16N_2) ; harness RGB_LED.GREEN
LED3_R: U1#1.V11(IO_L13P_2) ; harness RGB_LED.RED
LED4_B: U1#1.AA23(IO_L09N_1) ; harness RGB_LED.BLUE
LED4_G: U1#1.AC25(IO_L05N_1) ; harness RGB_LED.GREEN
LED4_R: U1#1.Y21(IO_L01N_1/LDC2) ; harness RGB_LED.RED
LED5_B: U1#1.AC26(IO_L06P_1) ; harness RGB_LED.BLUE
LED5_G: U1#1.W21(IO_L04N_1) ; harness RGB_LED.GREEN
LED5_R: U1#1.Y22(IO_L13P_1) ; harness RGB_LED.RED
LED6_B: U1#1.W23(IO_L18P_1) ; harness RGB_LED.BLUE
LED6_G: U1#1.Y23(IO_L13N_1) ; harness RGB_LED.GREEN
LED6_R: U1#1.V21(IO_L10P_1) ; harness RGB_LED.RED
LED7_B: U1#1.AB24(IO_L07N_1/VREF_1) ; harness RGB_LED.BLUE
LED7_G: U1#1.Y24(IO_L15P_1) ; harness RGB_LED.GREEN
LED7_R: U1#1.V19(IO_L08N_1) ; harness RGB_LED.RED
MIDI_RX: U1#1.C4(IP_0) ; port MIDI.MIDI_RX  [project net MIDI.MIDI_RX]
MIDI_TX: U1#1.H7(IO_L03N_3) ; port MIDI.MIDI_TX  [project net MIDI.MIDI_TX]
MOUSECLOCK: U1#1.AB9(IO_L15P_2) ; port MOUSE.CLOCK  [project net MOUSE.CLOCK]
MOUSEDATA: U1#1.W7(IO_L63P_3) ; port MOUSE.DATA  [project net MOUSE.DATA]
NEXUS_TCK: U1#1.AF14(IO_L28P_2/GCLK2) ; harness JTAG.TCK
NEXUS_TDI: U1#1.AA19(IP_2) ; harness JTAG.TDI
NEXUS_TDO: U1#1.AC20(IO_L41N_2) ; harness JTAG.TDO
NEXUS_TMS: U1#1.AB20(IP_2) ; harness JTAG.TMS
ONE_WIRE_DB_PB: R283.2 U1#1.R2(IO_L36N_3) ; port ONE_WIRE_DB_PB
P0_PWM: U1#1.C7(IO_L42N_0) ; port PWM.PWM0  [project net PWM.PWM0]
P1_PWM: U1#1.B6(IO_L41P_0) ; port PWM.PWM1  [project net PWM.PWM1]
P2_PWM: U1#1.A4(IO_L45P_0) ; port PWM.PWM2  [project net PWM.PWM2]
P3_PWM: U1#1.B4(IO_L45N_0) ; port PWM.PWM3  [project net PWM.PWM3]
PROG_B: R24#1.2 ; sheet U_FPGA_Power/PROG_B
REF_CLK: U1#1.K14(IO_L25P_0/GCLK4) ; port DB_CLOCKS.REF_CLK  [project net DB_CLOCKS.REF_CLK]
RELAY0: U1#1.C6(IO_L41N_0)
RELAY1: U1#1.C10(IO_L34P_0)
RELAY2: U1#1.C12(IO_L30N_0)
RELAY3: U1#1.B12(IO_L29N_0)
RS232_CTS: U1#1.J2(IP_L20N_3/VREF_3) ; port RS232.CTS  [project net RS232.CTS]
RS232_RTS: U1#1.E3(IO_L07P_3) ; port RS232.RTS  [project net RS232.RTS]
RS232_RX: U1#1.G2(IP_L16P_3) ; port RS232.RXD  [project net RS232.RXD]
RS232_TX: U1#1.B1(IO_L02N_3) ; port RS232.TXD  [project net RS232.TXD]
SCL: R277.2 U1#1.V5(IO_L49N_3) ; port I2C.SCL  [project net I2C.SCL]
SDA: R278.1 U1#1.U7(IO_L56P_3) ; port I2C.SDA  [project net I2C.SDA]
SDCLK: U1#1.AA13(IO_L25P_2/GCLK12) ; port DBSD.CLK  [project net DBSD.CLK]
SDCMD: U1#1.V12(IO_L16P_2) ; port DBSD.CMD  [project net DBSD.CMD]
SDDAT0: U1#1.V16(IO_L42P_2)
SDDAT1: U1#1.V18(IO_L08P_1)
SDDAT2: U1#1.V13(IO_L20P_2)
SDDAT3: U1#1.U11(IO_L13N_2)
SDDETECT: U1#1.AC13(IP_2) ; port DBSD.DETECT  [project net DBSD.DETECT]
SDPROTECT: U1#1.AB13(IP_2) ; port DBSD.PROTECT  [project net DBSD.PROTECT]
SPAREIO1: U1#1.W9(IO_L05P_2) ; port SPAREIO.1  [project net SPAREIO.1]
SPAREIO2: U1#1.W10(IO_L09N_2) ; port SPAREIO.2  [project net SPAREIO.2]
SPAREIO3: U1#1.Y9(IO_L05N_2) ; port SPAREIO.3  [project net SPAREIO.3]
SPAREIO4: U1#1.Y10(IO_L12P_2) ; port SPAREIO.4  [project net SPAREIO.4]
SPDIF_IN: U1#1.AF2(IP_2) ; port SPDIF.IN  [project net SPDIF.IN]
SPDIF_OUT: U1#1.V10(IO_L09P_2) ; port SPDIF.OUT  [project net SPDIF.OUT]
SRAM1_A0: U1#1.J12(IO_L39P_0)
SRAM1_A1: U1#1.F14(IO_L24N_0)
SRAM1_A2: U1#1.F15(IO_L20P_0)
SRAM1_A3: U1#1.G17(IO_L08N_0)
SRAM1_A4: U1#1.B19(IO_L15P_0)
SRAM1_A5: U1#1.K21(IO_L50N_1)
SRAM1_A6: U1#1.K23(IO_L46P_1)
SRAM1_A7: U1#1.L9(IO_L15N_3)
SRAM1_A8: U1#1.M18(IO_L47N_1)
SRAM1_A9: U1#1.N9(IO_L35P_3/TRDY2/LHCLK6)
SRAM1_A10: U1#1.M20(IO_L42N_1/A17)
SRAM1_A11: U1#1.L18(IO_L55P_1)
SRAM1_A12: U1#1.L17(IO_L55N_1)
SRAM1_A13: U1#1.J23(IO_L49P_1)
SRAM1_A14: U1#1.J19(IO_L59P_1)
SRAM1_A15: U1#1.B15(IO_L23P_0)
SRAM1_A16: U1#1.G12(IO_L35P_0)
SRAM1_A17: U1#1.F12(IO_L31N_0)
SRAM1_A18: U1#1.H21(IO_L62N_1/A21)
SRAM1_D0: U1#1.D21(IO_L10N_0)
SRAM1_D1: U1#1.B23(IO_L07P_0)
SRAM1_D2: U1#1.C21(IO_L09P_0)
SRAM1_D3: U1#1.D17(IO_L21P_0)
SRAM1_D4: U1#1.C26(IO_L63P_1/A22)
SRAM1_D5: U1#1.G20(IO_L01P_0)
SRAM1_D6: U1#1.F22(IO_L58P_1/VREF_1)
SRAM1_D7: U1#1.G22(IO_L58N_1)
SRAM1_D8: U1#1.G21(IO_L64N_1/A25)
SRAM1_D9: U1#1.E26(IO_L60P_1)
SRAM1_D10: U1#1.D26(IO_L60N_1)
SRAM1_D11: U1#1.D24(IO_L61N_1)
SRAM1_D12: U1#1.H10(IO_L46N_0)
SRAM1_D13: U1#1.B18(IO_L18P_0)
SRAM1_D14: U1#1.E21(IO_L10P_0)
SRAM1_D15: U1#1.F19(IO_L02N_0)
SRAM1_NBHE: U1#1.G15(IO_L16P_0) ; port SRAM1.NBHE  [project net DB_SRAM1.NBHE]
SRAM1_NBLE: U1#1.E17(IO_L13N_0) ; port SRAM1.NBLE  [project net DB_SRAM1.NBLE]
SRAM1_NCS: U1#1.C20(IO_L11N_0) ; port SRAM1.NCS  [project net DB_SRAM1.NCS]
SRAM1_NOE: U1#1.E14(IO_L24P_0) ; port SRAM1.NOE  [project net DB_SRAM1.NOE]
SRAM1_NWE: U1#1.J20(IO_L59N_1) ; port SRAM1.NWE  [project net DB_SRAM1.NWE]
SRAM2_A0: U1#1.D16(IO_L22P_0)
SRAM2_A1: U1#1.D18(IO_L17P_0)
SRAM2_A2: U1#1.A20(IO_L14N_0)
SRAM2_A3: U1#1.D20(IO_L11P_0)
SRAM2_A4: U1#1.F20(IO_L01N_0)
SRAM2_A5: U1#1.K18(IO_L57N_1)
SRAM2_A6: U1#1.M22(IO_L45N_1)
SRAM2_A7: U1#1.N19(IO_L34N_1/RHCLK7)
SRAM2_A8: U1#1.N17(IO_L39N_1/A15)
SRAM2_A9: U1#1.N18(IO_L39P_1/A14)
SRAM2_A10: U1#1.N20(IO_L42P_1/A16)
SRAM2_A11: U1#1.M23(IO_L38N_1/A13)
SRAM2_A12: U1#1.M21(IO_L45P_1)
SRAM2_A13: U1#1.L20(IO_L53P_1)
SRAM2_A14: U1#1.K22(IO_L46N_1)
SRAM2_A15: U1#1.F17(IO_L13P_0)
SRAM2_A16: U1#1.H15(IO_L16N_0)
SRAM2_A17: U1#1.E15(IO_L20N_0/VREF_0)
SRAM2_A18: U1#1.K19(IO_L57P_1)
SRAM2_D0: U1#1.J16(IO_L12P_0)
SRAM2_D1: U1#1.G19(IO_L02P_0/VREF_0)
SRAM2_D2: U1#1.C23(IO_L06N_0)
SRAM2_D3: U1#1.H17(IO_L08P_0)
SRAM2_D4: U1#1.K16(IO_L12N_0)
SRAM2_D5: U1#1.H20(IO_L64P_1/A24)
SRAM2_D6: U1#1.F23(IO_L56N_1)
SRAM2_D7: U1#1.K9(IO_L05P_3)
SRAM2_D8: U1#1.G23(IO_L51P_1)
SRAM2_D9: U1#1.F24(IO_L54N_1)
SRAM2_D10: U1#1.E24(IO_L56P_1)
SRAM2_D11: U1#1.D25(IO_L61P_1)
SRAM2_D12: U1#1.A18(IO_L18N_0)
SRAM2_D13: U1#1.C22(IO_L05N_0)
SRAM2_D14: U1#1.D23(IO_L06P_0)
SRAM2_D15: U1#1.D22(IO_L05P_0)
SRAM2_NBHE: U1#1.B20(IO_L14P_0/VREF_0) ; port SRAM2.NBHE  [project net DB_SRAM2.NBHE]
SRAM2_NBLE: U1#1.B21(IO_L09N_0) ; port SRAM2.NBLE  [project net DB_SRAM2.NBLE]
SRAM2_NCS: U1#1.K11(IO_L43N_0) ; port SRAM2.NCS  [project net DB_SRAM2.NCS]
SRAM2_NOE: U1#1.A19(IO_L15N_0) ; port SRAM2.NOE  [project net DB_SRAM2.NOE]
SRAM2_NWE: U1#1.K20(IO_L53N_1) ; port SRAM2.NWE  [project net DB_SRAM2.NWE]
SW0: U1#1.K1(IP_L24N_3)
SW1: U1#1.U3(IP_L46P_3)
SW2: U1#1.W2(IP_L50N_3/VREF_3)
SW3: U1#1.V4(IP_L46N_3)
SW4: U1#1.W1(IP_L50P_3)
TCK: R9#1.2 ; sheet U_FPGA_Power/TCK
TDI: R12#1.2 ; sheet U_FPGA_Power/TDI
TDO: R10#1.2 ; sheet U_FPGA_Power/TDO
TFT_BLIGHT: U1#1.AC23(IO_L03P_1/A0) ; port TFT_IO.BL  [project net TFT_IO.BL]
TFT_CS: U1#1.AC16(IO_L38P_2) ; port TFT_IO.CS  [project net TFT_IO.CS]
TFT_DB0: U1#1.AD14(IO_L29P_2)
TFT_DB1: U1#1.AB15(IO_L30N_2/MOSI/CSI_B)
TFT_DB2: U1#1.AE12(IO_L24N_2/D4)
TFT_DB3: U1#1.AE15(IO_L32N_2/DOUT)
TFT_DB4: U1#1.AF23(IO_L48P_2)
TFT_DB5: U1#1.AC15(IO_L30P_2)
TFT_DB6: U1#1.AC14(IO_L29N_2)
TFT_DB7: U1#1.AC12(IO_L21N_2)
TFT_DB10: U1#1.AC21(IO_L45N_2)
TFT_DB11: U1#1.AD22(IO_L45P_2)
TFT_DB12: U1#1.AC19(IO_L40N_2)
TFT_DB13: U1#1.Y17(IO_L43N_2)
TFT_DB14: U1#1.AD19(IO_L40P_2)
TFT_DB15: U1#1.W17(IO_L46P_2)
TFT_DB16: U1#1.AB16(IO_L38N_2)
TFT_DB17: U1#1.W15(IO_L31N_2)
TFT_RD: U1#1.AD20(IO_L41P_2) ; port TFT_IO.RD  [project net TFT_IO.RD]
TFT_RESET: U1#1.V15(IO_L35P_2) ; port TFT_IO.RESET  [project net TFT_IO.RESET]
TFT_RS: U1#1.AF18(IO_L36P_2/D2) ; port TFT_IO.RS  [project net TFT_IO.RS]
TFT_TSC_BUSY: U1#1.W26(IP_L20P_1) ; port TFT_TSC.BUSY  [project net TFT_TSC.BUSY]
TFT_TSC_CLK: U1#1.Y13(IO_L25N_2/GCLK13) ; port TFT_TSC.CLK  [project net TFT_TSC.CLK]
TFT_TSC_CS_N: U1#1.AB26(IO_L06N_1) ; port TFT_TSC.CS_N  [project net TFT_TSC.CS_N]
TFT_TSC_DIN: U1#1.AD26(IO_L05P_1) ; port TFT_TSC.DIN  [project net TFT_TSC.DIN]
TFT_TSC_DOUT: U1#1.W25(IP_L16P_1) ; port TFT_TSC.DOUT  [project net TFT_TSC.DOUT]
TFT_TSC_IRQ_N: U1#1.AE25(IO_L51N_2) ; port TFT_TSC.TFT_INT  [project net TFT_TSC.TFT_INT]
TFT_WR: U1#1.AE18(IO_L36N_2/D1) ; port TFT_IO.WR  [project net TFT_IO.WR]
TMS: R8#1.2 ; sheet U_FPGA_Power/TMS
USB_D0: U1#1.AE17(IO_L33P_2)  [project net HUSB_D0]
USB_D1: U1#1.U15(IO_L35N_2)  [project net HUSB_D1]
USB_D2: U1#1.AD17(IO_L33N_2)  [project net HUSB_D2]
USB_D3: U1#1.Y15(IO_L34N_2/D3)  [project net HUSB_D3]
USB_D4: U1#1.AC24(IO_L03N_1/A1)  [project net HUSB_D4]
USB_D5: U1#1.AF19(IO_L37P_2)  [project net HUSB_D5]
USB_D6: U1#1.AE19(IO_L37N_2)  [project net HUSB_D6]
USB_D7: U1#1.AF20(IO_L39P_2)  [project net HUSB_D7]
USB_FIFOADR0: U1#1.AA17(IO_L43P_2) ; port DBUSB.FIFOADR0  [project net DBUSB.FIFOADR0]
USB_FIFOADR1: U1#1.AD25(IO_L02N_1/LDC0) ; port DBUSB.FIFOADR1  [project net DBUSB.FIFOADR1]
USB_FIFOADR2: U1#1.AA18(IO_L47N_2) ; port DBUSB.FIFOADR2  [project net DBUSB.FIFOADR2]
USB_FLAGA: U1#1.AC17(IP_2) ; port DBUSB.FLAGA  [project net DBUSB.FLAGA]
USB_FLAGB: U1#1.AB17(IP_2) ; port DBUSB.FLAGB  [project net DBUSB.FLAGB]
USB_FLAGC: U1#1.AA20(IP_2/VREF_2) ; port DBUSB.FLAGC  [project net DBUSB.FLAGC]
USB_FLAGD_CS_N: U1#1.AE20(IO_L39N_2) ; port DBUSB.FLAGD_CS_N  [project net DBUSB.FLAGD_CS_N]
USB_IFCLK: U1#1.V14(IO_L31P_2) ; port DBUSB.IFCLK  [project net DBUSB.IFCLK]
USB_INT_N: U1#1.AF22(IP_2/VREF_2) ; port DBUSB.INT_N  [project net DBUSB.INT_N]
USB_PKTEND: U1#1.AE21(IO_L44P_2) ; port DBUSB.PKTEND  [project net DBUSB.PKTEND]
USB_RD_N: U1#1.U16(IO_L42N_2) ; port DBUSB.RD_N  [project net DBUSB.RD_N]
USB_READY: U1#1.R24(IP_L28N_1) ; port DBUSB.READY  [project net DBUSB.READY]
USB_RESET_N: U1#1.V17(IO_L46N_2) ; port DBUSB.RESET_N  [project net DBUSB.RESET_N]
USB_SLOE: U1#1.AB18(IO_L47P_2) ; port DBUSB.SLOE  [project net DBUSB.SLOE]
USB_VBUS: U1#1.AC18(IP_2) ; port DBUSB.VBUS  [project net DBUSB.VBUS]
USB_WR_N: U1#1.U18(IO_L12N_1) ; port DBUSB.WR_N  [project net DBUSB.WR_N]
VGA_BLUE0: U1#1.K12(IO_L39N_0)
VGA_BLUE1: U1#1.D11(IO_L32N_0/VREF_0)
VGA_BLUE2: U1#1.J11(IO_L43P_0)
VGA_BLUE3: U1#1.A10(IO_L33P_0)
VGA_BLUE4: U1#1.B10(IO_L33N_0)
VGA_BLUE5: U1#1.D10(IO_L34N_0)
VGA_BLUE6: U1#1.G10(IO_L46P_0)
VGA_BLUE7: U1#1.E10(IO_L37P_0)
VGA_CLK: U1#1.C5(IO_L44P_0) ; port VGA.VGA_CLK  [project net VGA.VGA_CLK]
VGA_GREEN0: U1#1.D8(IO_L40N_0)
VGA_GREEN1: U1#1.C8(IO_L40P_0)
VGA_GREEN2: U1#1.F8(IO_L52P_0/VREF_0)
VGA_GREEN3: U1#1.B7(IO_L42P_0)
VGA_GREEN4: U1#1.E7(IO_L48N_0)
VGA_GREEN5: U1#1.F7(IO_L48P_0)
VGA_GREEN6: U1#1.D6(IO_L44N_0)
VGA_GREEN7: U1#1.G8(IO_L52N_0/PUDC_B)
VGA_HSYNC: U1#1.C11(IO_L32P_0) ; port VGA.VGA_HSYNC  [project net VGA#.HSYNC]
VGA_RED0: U1#1.A9(IO_L36P_0)
VGA_RED1: U1#1.B9(IO_L36N_0)
VGA_RED2: U1#1.D9(IO_L37N_0)
VGA_RED3: U1#1.G9(IO_L47P_0)
VGA_RED4: U1#1.A8(IO_L38P_0)
VGA_RED5: U1#1.J9(IO_L01N_3)
VGA_RED6: U1#1.H9(IO_L47N_0)
VGA_RED7: U1#1.B8(IO_L38N_0)
VGA_VSYNC: U1#1.H12(IO_L35N_0) ; port VGA.VGA_VSYNC  [project net VGA#.VSYNC]

Not connected (* = marked no-connect by the designer): U1#1 A13(IP_0)* A17(IP_0)* A23(IP_0)* AA4(IP_L58P_3)* AA5(IP_L58N_3/VREF_3)* AB3(IP_L62P_3)* AD16(IP_2)* AE1(IP_L66P_3)* B25(IP_L65N_1)* D12(IP_0)* D14(IP_0/VREF_0)* D15(IP_0)* D19(IP_0)* E11(IP_0)* E12(IO_L31P_0)* E18(IP_0)* E20(IP_0)* F10(IP_0)* G11(IP_0/VREF_0)* G14(IP_0)* G16(IP_0)* G25(IP_L52N_1/VREF_1)* G26(IP_L52P_1)* H13(IP_0)* H18(IP_0)* H23(IP_L48P_1)* H24(IP_L48N_1)* H25(IP_L44N_1)* H26(IP_L44P_1/VREF_1)* J3(IP_L20P_3)* J10(IP_0)* J13(IP_0)* J15(IP_0)* J17(IP_0/VREF_0)* K24(IP_L40P_1)* L23(IP_L40N_1)* M24(IP_L36P_1/VREF_1)* N23(IP_L36N_1)* N25(IP_L32N_1)* N26(IP_L32P_1)* R23(IP_L28P_1/VREF_1)* U25(IP_L24P_1)* U26(IP_L24N_1/VREF_1)* V26(IP_L20N_1/VREF_1)* Y3(IP_L54P_3)* Y4(IP_L54N_3)* Y11(IP_2)* Y16(IP_2/VREF_2)*

### Buses and harness runs
bus BUS_A[17..1]
bus BUS_A[24..1]
bus BUS_D[31..0]
bus BUS_NBE[3..0]
bus DIP[7..0]
bus E_RXD[3..0]
bus E_TXD[3..0]
bus EXTEND_A[49..0]
bus FPGA_ID[3..0]
bus FPGA_M[2..0]
bus IO[35..0]
bus RELAY[3..0]
bus SDDAT[3..0]
bus SRAM1_A[18..0]
bus SRAM1_D[15..0]
bus SRAM2_A[18..0]
bus SRAM2_D[15..0]
bus SW[4..0]
bus TFT_DB[17..0]
bus USB_D[15..0]
bus VGA_BLUE[7..0]
bus VGA_GREEN[7..0]
bus VGA_RED[7..0]

### Notes on the sheet
- USER/DB FPGA
- JTAG
- PROGRAM
- SPI
- CLOCKS
- COMMON MEMORY RESOURCES
- USB2
- (near NT3#2) STANDALON MEMORY RESOURCES
- 24MHz provided on top level schematic
- PERIPHERALS
- (near R4#1) 1V2
- 3V3
- FPGA_ID = 0x4
- Project Title
- Sheet Title
- Size:
- Date:
- File:
- A2
- Assy:
- Time:
- Revision:
- Sheet
- of
- (in symbol D-241-0015, part A) BANK 0
- (in symbol D-241-0015, part B) BANK 1
- (in symbol D-241-0015, part C) BANK 2
- (in symbol D-241-0015, part D) BANK 3

### Library data of the parts
NT2#2 NT3#2 NT3#3 NT4 NT5 = D-002-0002: Net-Tie, Surface Mount, 2 x 0.4mm x 0.2mm SMT Pads - For 0.2mm Track; Status: Production; Category: Net-Tie
R1#1 R2#1 R3#1 R4#1 R277 R278 R283 = D-100-0088: Resistor, 4K7 1% 0402 (1005); Power Rating: 63 mW; Resistance: 4.7 K; Mounting Technology: Surface Mount; Status: Production; Tolerance: 1 %; Category: Resistor
R8#1 R9#1 R10#1 R12#1 R14#1 R18#1 R20#1 R22#1 R23#1 R24#1 = D-100-0131: Resistor, 100R 1% 0402 (1005); Power Rating: 63 mW; Mounting Technology: Surface Mount; Resistance: 100 R; Status: Production; Tolerance: 1 %; Category: Resistor
R272-R275 = D-100-0107: Resistor, 2K2 1% 0402 (1005); Power Rating: 63 mW; Resistance: 2.2 K; Category: Resistor; Mounting Technology: Surface Mount; Status: Production; Tolerance: 1 %
U1#1 = D-241-0015: FPGA, Xilinx Spartan 3AN-1400 FG676; Supply Voltage: mV; Mounting Technology: Surface Mount; Status: Unreleased; Technology: None; Category: IC-FPGA; NexusDeviceId: XC3S1400AN-4FG676C